# Altium project dmpro16-pcb-v1.PrjPcb
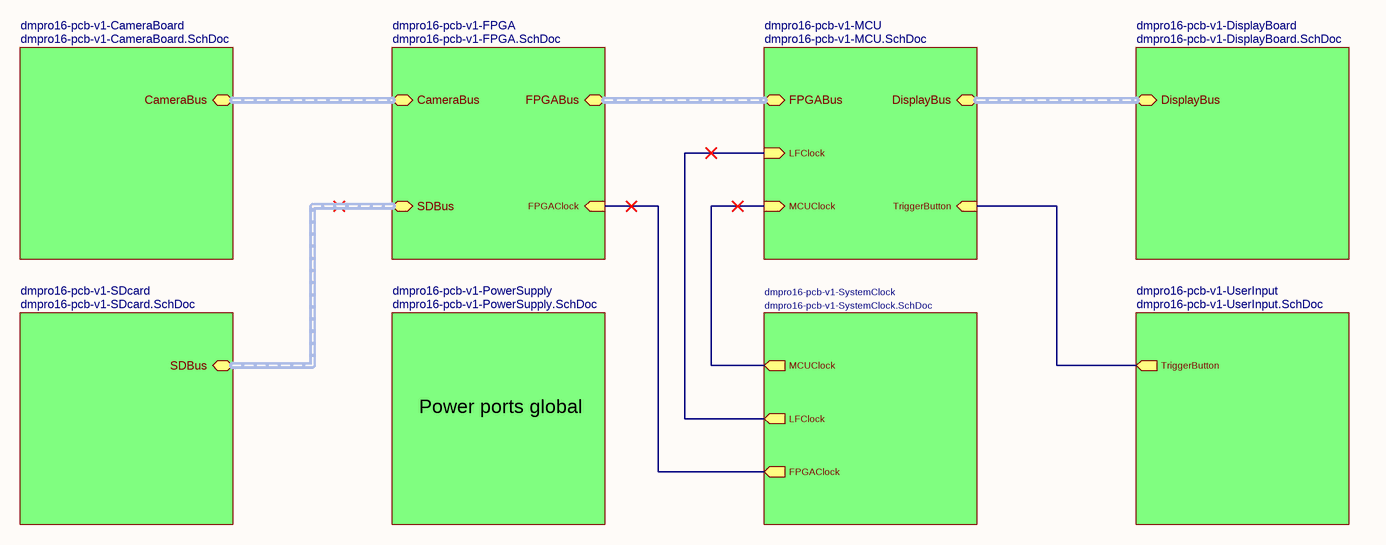
[diagram p0: dmpro16-pcb-v1-TopLevel.SchDoc]
BoardName: sudo -ku; Groupname: Energy; Subject: TDT4295 Computer Project; Version: 1.0
17 sheets, 117 parts. Net scope: hierarchical (ports join the sheet entries above them; power ports are global).
Board file: PCB.PcbDoc
Sheets:
  dmpro16-pcb-v1-TopLevel.SchDoc
    dmpro16-pcb-v1-FPGA = dmpro16-pcb-v1-FPGA.SchDoc
      dmpro16-pcb-v1-FPGA-Bank14 = dmpro16-pcb-v1-FPGA-Bank14.SchDoc
      dmpro16-pcb-v1-FPGA-Bank15 = dmpro16-pcb-v1-FPGA-Bank15.SchDoc
      dmpro16-pcb-v1-FPGA-Bank34 = dmpro16-pcb-v1-FPGA-Bank34.SchDoc
      dmpro16-pcb-v1-FPGA-Bank35 = dmpro16-pcb-v1-FPGA-Bank35.SchDoc
      dmpro16-pcb-v1-FPGA-Power = dmpro16-pcb-v1-FPGA-Power.SchDoc
      dmpro16-pcb-v1-FPGA-Config = dmpro16-pcb-v1-FPGA-Config.SchDoc
    dmpro16-pcb-v1-MCU = dmpro16-pcb-v1-MCU.SchDoc
      dmpro16-pcb-v1-MCU-Power = dmpro16-pcb-v1-MCU-Power.SchDoc
      dmpro16-pcb-v1-MCU-GPIO = dmpro16-pcb-v1-MCU-GPIO.SchDoc
    dmpro16-pcb-v1-CameraBoard = dmpro16-pcb-v1-CameraBoard.SchDoc
    dmpro16-pcb-v1-SDcard = dmpro16-pcb-v1-SDcard.SchDoc
    dmpro16-pcb-v1-DisplayBoard = dmpro16-pcb-v1-DisplayBoard.SchDoc
    dmpro16-pcb-v1-UserInput = dmpro16-pcb-v1-UserInput.SchDoc
    dmpro16-pcb-v1-PowerSupply = dmpro16-pcb-v1-PowerSupply.SchDoc
    dmpro16-pcb-v1-SystemClock = dmpro16-pcb-v1-SystemClock.SchDoc

## Sheet dmpro16-pcb-v1-TopLevel.SchDoc
size A4; DocumentNumber: 1; SheetNumber: 1; SheetTotal: 17; SheetName: TopLevel

### Sub-sheets
dmpro16-pcb-v1-CameraBoard = dmpro16-pcb-v1-CameraBoard.SchDoc: CameraBus (harness CameraBus)
dmpro16-pcb-v1-DisplayBoard = dmpro16-pcb-v1-DisplayBoard.SchDoc: DisplayBus (harness DisplayBus)
dmpro16-pcb-v1-FPGA = dmpro16-pcb-v1-FPGA.SchDoc: CameraBus (harness CameraBus), FPGABus (harness FPGABus), SDBus (harness SDBus), FPGAClock (in)
dmpro16-pcb-v1-MCU = dmpro16-pcb-v1-MCU.SchDoc: FPGABus (harness FPGABus), DisplayBus (harness DisplayBus), MCUClock (in), TriggerButton (in), LFClock (in)
dmpro16-pcb-v1-PowerSupply = dmpro16-pcb-v1-PowerSupply.SchDoc: no entries
dmpro16-pcb-v1-SDcard = dmpro16-pcb-v1-SDcard.SchDoc: SDBus (harness SDBus)
dmpro16-pcb-v1-SystemClock = dmpro16-pcb-v1-SystemClock.SchDoc: MCUClock (out), LFClock (out), FPGAClock (out)
dmpro16-pcb-v1-UserInput = dmpro16-pcb-v1-UserInput.SchDoc: TriggerButton (out)

### Nets
TriggerButton: sheet dmpro16-pcb-v1-MCU/TriggerButton, sheet dmpro16-pcb-v1-UserInput/TriggerButton
NetU1_H2: sheet dmpro16-pcb-v1-FPGA/FPGAClock, sheet dmpro16-pcb-v1-SystemClock/FPGAClock
NetU9_L1: sheet dmpro16-pcb-v1-MCU/LFClock, sheet dmpro16-pcb-v1-SystemClock/LFClock
NetU9_L9: sheet dmpro16-pcb-v1-MCU/MCUClock, sheet dmpro16-pcb-v1-SystemClock/MCUClock

### Buses and harness runs
harness sheet dmpro16-pcb-v1-CameraBoard/CameraBus = sheet dmpro16-pcb-v1-FPGA/CameraBus
harness sheet dmpro16-pcb-v1-DisplayBoard/DisplayBus = sheet dmpro16-pcb-v1-MCU/DisplayBus
harness sheet dmpro16-pcb-v1-FPGA/FPGABus = sheet dmpro16-pcb-v1-MCU/FPGABus
harness sheet dmpro16-pcb-v1-FPGA/SDBus = sheet dmpro16-pcb-v1-SDcard/SDBus

### Notes on the sheet
- Power ports global
- Board:
- Version:
- Sheetname:
- Subject:
- Group:
- Sheet
- of
- Shematic file:

## Sheet dmpro16-pcb-v1-FPGA.SchDoc
size A4; DocumentNumber: 4; SheetNumber: 4; SheetTotal: 17; SheetName: FPGA
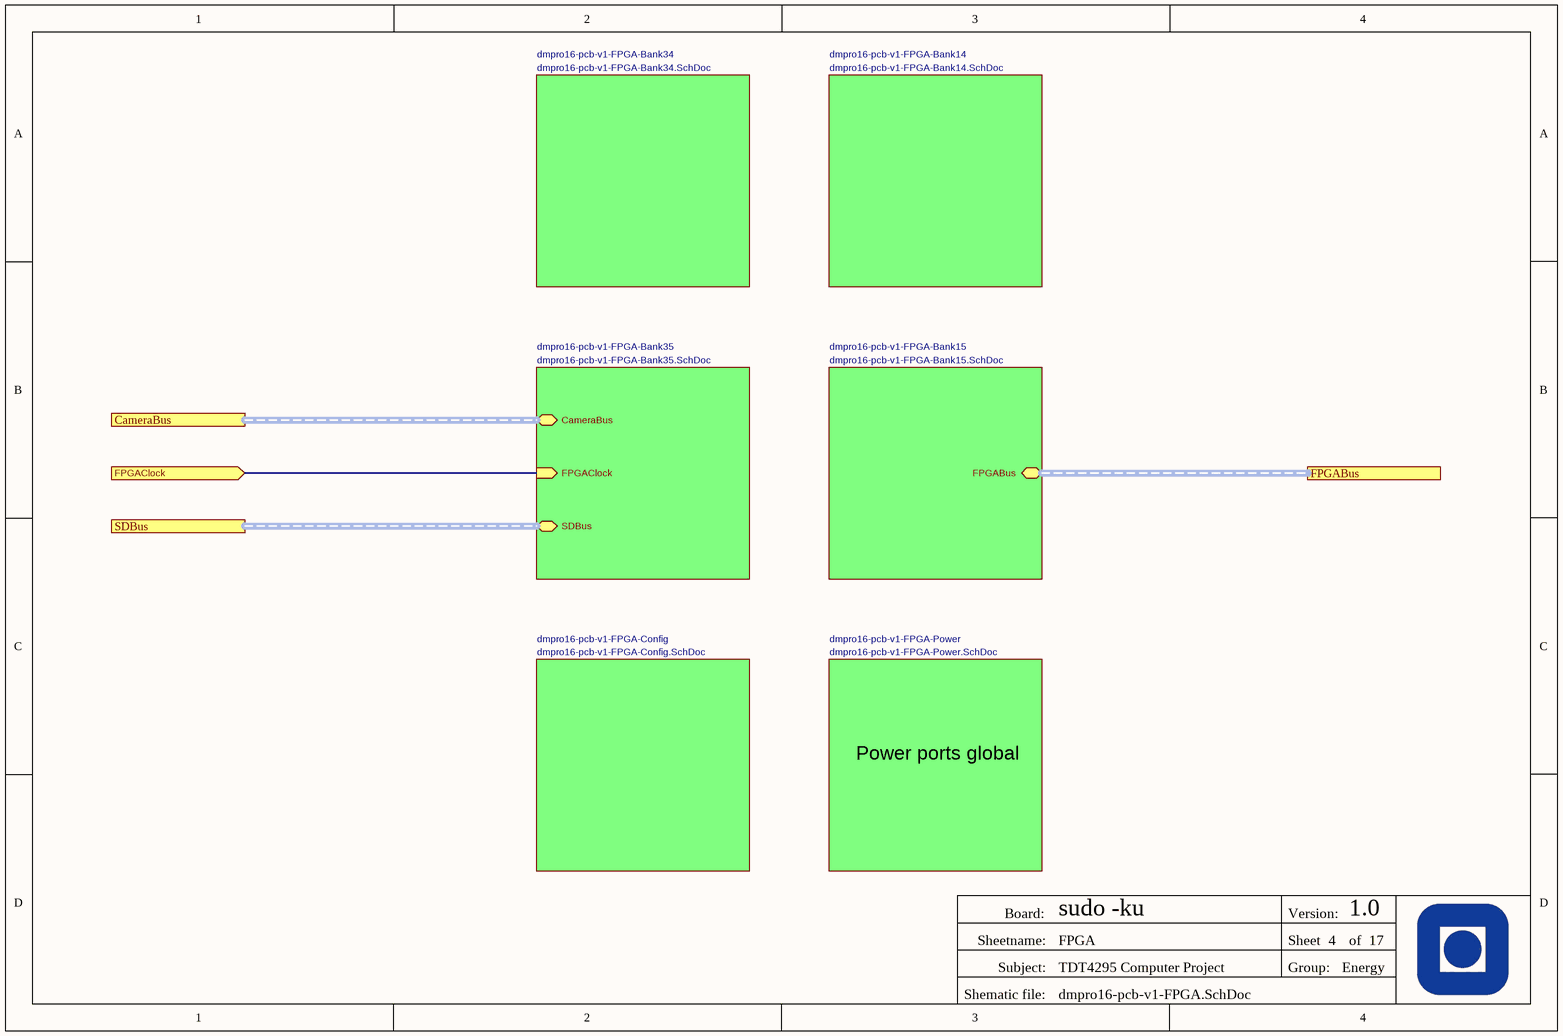
[diagram p1: dmpro16-pcb-v1-FPGA.SchDoc]

### Sub-sheets
dmpro16-pcb-v1-FPGA-Bank14 = dmpro16-pcb-v1-FPGA-Bank14.SchDoc: no entries
dmpro16-pcb-v1-FPGA-Bank15 = dmpro16-pcb-v1-FPGA-Bank15.SchDoc: FPGABus (harness FPGABus)
dmpro16-pcb-v1-FPGA-Bank34 = dmpro16-pcb-v1-FPGA-Bank34.SchDoc: no entries
dmpro16-pcb-v1-FPGA-Bank35 = dmpro16-pcb-v1-FPGA-Bank35.SchDoc: SDBus (harness SDBus), CameraBus (harness CameraBus), FPGAClock (in)
dmpro16-pcb-v1-FPGA-Config = dmpro16-pcb-v1-FPGA-Config.SchDoc: no entries
dmpro16-pcb-v1-FPGA-Power = dmpro16-pcb-v1-FPGA-Power.SchDoc: no entries

### Ports
CameraBus (harness CameraBus), FPGABus (harness FPGABus), FPGAClock (in), SDBus (harness SDBus)

### Nets
NetU1_H2: port FPGAClock, sheet dmpro16-pcb-v1-FPGA-Bank35/FPGAClock

### Buses and harness runs
harness port CameraBus = sheet dmpro16-pcb-v1-FPGA-Bank35/CameraBus
harness port FPGABus = sheet dmpro16-pcb-v1-FPGA-Bank15/FPGABus
harness port SDBus = sheet dmpro16-pcb-v1-FPGA-Bank35/SDBus

### Notes on the sheet
- Power ports global
- Board:
- Version:
- Sheetname:
- Subject:
- Group:
- Sheet
- of
- Shematic file:

## Sheet dmpro16-pcb-v1-FPGA-Bank14.SchDoc
size A4; DocumentNumber: 5; SheetNumber: 5; SheetTotal: 17; SheetName: FPGA-Bank14
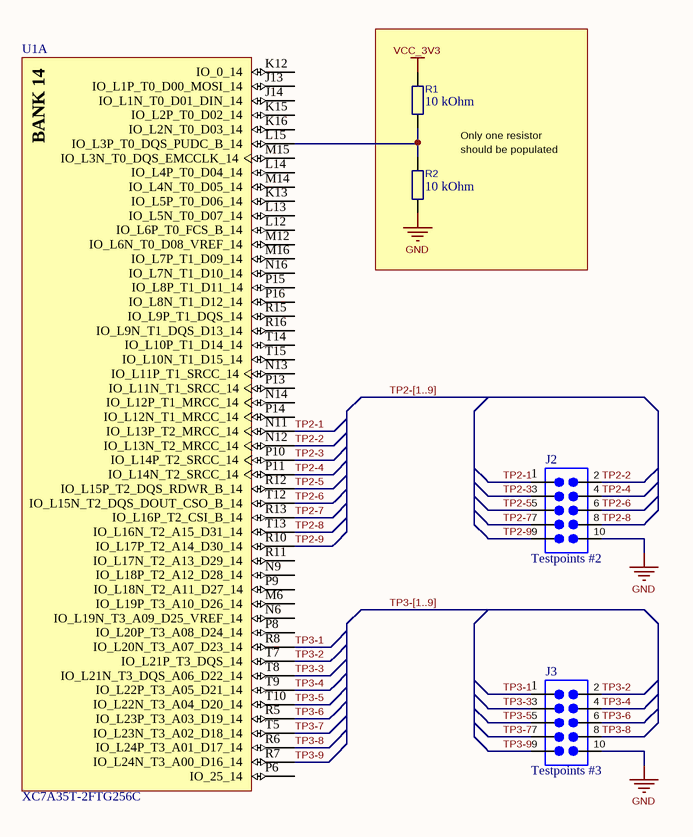
[diagram p2: dmpro16-pcb-v1-FPGA-Bank14.SchDoc]

### Parts
J2  Testpoints #2  [HEADER_2X5]
J3  Testpoints #3  [HEADER_2X5]
R1  10 kOhm  [Resistor 2012]
R2  10 kOhm  [Resistor 2012]
U1  XC7A35T-2FTG256C  [FTG256]  (part A of 8)

### Nets
GND: J2.10 J3.10 R2.2
VCC_3V3: R1.1
TP2-1: J2.1 U1.N11(IO_L13P_T2_MRCC_14)
TP2-2: J2.2 U1.N12(IO_L13N_T2_MRCC_14)
TP2-3: J2.3 U1.P10(IO_L14P_T2_SRCC_14)
TP2-4: J2.4 U1.P11(IO_L14N_T2_SRCC_14)
TP2-5: J2.5 U1.R12(IO_L15P_T2_DQS_RDWR_B_14)
TP2-6: J2.6 U1.T12(IO_L15N_T2_DQS_DOUT_CSO_B_14)
TP2-7: J2.7 U1.R13(IO_L16P_T2_CSI_B_14)
TP2-8: J2.8 U1.T13(IO_L16N_T2_A15_D31_14)
TP2-9: J2.9 U1.R10(IO_L17P_T2_A14_D30_14)
TP3-1: J3.1 U1.R8(IO_L20N_T3_A07_D23_14)
TP3-2: J3.2 U1.T7(IO_L21P_T3_DQS_14)
TP3-3: J3.3 U1.T8(IO_L21N_T3_DQS_A06_D22_14)
TP3-4: J3.4 U1.T9(IO_L22P_T3_A05_D21_14)
TP3-5: J3.5 U1.T10(IO_L22N_T3_A04_D20_14)
TP3-6: J3.6 U1.R5(IO_L23P_T3_A03_D19_14)
TP3-7: J3.7 U1.T5(IO_L23N_T3_A02_D18_14)
TP3-8: J3.8 U1.R6(IO_L24P_T3_A01_D17_14)
TP3-9: J3.9 U1.R7(IO_L24N_T3_A00_D16_14)
NetR1_2: R1.2 R2.1 U1.L15(IO_L3P_T0_DQS_PUDC_B_14)

Not connected (* = marked no-connect by the designer): U1 J13(IO_L1P_T0_D00_MOSI_14) J14(IO_L1N_T0_D01_DIN_14) K12(IO_0_14) K13(IO_L5P_T0_D06_14) K15(IO_L2P_T0_D02_14) K16(IO_L2N_T0_D03_14) L12(IO_L6P_T0_FCS_B_14) L13(IO_L5N_T0_D07_14) L14(IO_L4P_T0_D04_14) M6(IO_L19P_T3_A10_D26_14) M12(IO_L6N_T0_D08_VREF_14) M14(IO_L4N_T0_D05_14) M15(IO_L3N_T0_DQS_EMCCLK_14) M16(IO_L7P_T1_D09_14) N6(IO_L19N_T3_A09_D25_VREF_14) N9(IO_L18P_T2_A12_D28_14) N13(IO_L11P_T1_SRCC_14) N14(IO_L12P_T1_MRCC_14) N16(IO_L7N_T1_D10_14) P6(IO_25_14) P8(IO_L20P_T3_A08_D24_14) P9(IO_L18N_T2_A11_D27_14) P13(IO_L11N_T1_SRCC_14) P14(IO_L12N_T1_MRCC_14) P15(IO_L8P_T1_D11_14) P16(IO_L8N_T1_D12_14) R11(IO_L17N_T2_A13_D29_14) R15(IO_L9P_T1_DQS_14) R16(IO_L9N_T1_DQS_D13_14) T14(IO_L10P_T1_D14_14) T15(IO_L10N_T1_D15_14)

### Buses and harness runs
bus TP2-[1..9]
bus TP3-[1..9]

### Notes on the sheet
- Only one resistor
- should be populated
- Board:
- Version:
- Sheetname:
- Subject:
- Group:
- Sheet
- of
- Shematic file:
- (in symbol XC7A35T-2FTG256C, part A) BANK 14

### Library data of the parts
J2 J3 = con_head_2x05pin: Header 2x05pin
R1 R2 = res_1608_10kohm: 10 kOhm resistor (1608 metric); Watt rating: ? mW; Value: 10 kOhm
U1 = XC7A35T-2FTG256C: Artix-7 FPGA, 170 User I/Os, 0 GTP, 256-Ball BGA, Speed Grade 2, Commercial Grade, Pb-Free; Manufacturer: Xilinx; Total Block RAM: 1800 Kb; GTP: 0; Clock Mgmt Tiles (CMTs): 5; Logic Cells: 33280; Available User I/O: 170; Speed Grades: 2; DatasheetVersion: v1.15; PackageVersion: Rev. 1.11; PackageReference: FTG-256; PackageDescription: 256-Ball Wire-Bond Fine-Pitch Thin BGA, Body 17 x 17 mm, Pitch 1 mm; Maximum Distributed RAM: 400 Kb; Operating Temperature Range: Commercial; NexusDeviceID: XC7A35T-2FTG256C; Mounting Technology: Surface Mount; PartNumber: XC7A35T-2FTG256C; ComponentLink1Description: Manufacturer URL; ComponentLink1URL: http://www.xilinx.com/; ComponentLink2Description: Datasheet; ComponentLink2URL: http://www.xilinx.com/support/documentation/data_sheets/ds180_7Series_Overview.pdf; ComponentLink3Description: Package Specification; ComponentLink3URL: http://www.xilinx.com/support/documentation/user_guides/ug475_7Series_Pkg_Pinout.pdf; ComponentLink4Description: DC and Switching Characteristics; ComponentLink4URL: http://www.xilinx.com/support/documentation/data_sheets/ds181_Artix_7_Data_Sheet.pdf; ComponentLink5Description: Package File; ComponentLink5URL: http://www.xilinx.com/support/packagefiles/a7packages/xc7a200tsbg484pkg.txt; ComponentLink6Description: Packaging and Pinout; ComponentLink6URL: http://www.xilinx.com/support/documentation/user_guides/ug475_7Series_Pkg_Pinout.pdf

## Sheet dmpro16-pcb-v1-FPGA-Bank15.SchDoc
size A4; DocumentNumber: 6; SheetNumber: 6; SheetTotal: 17; SheetName: FPGA-Bank15
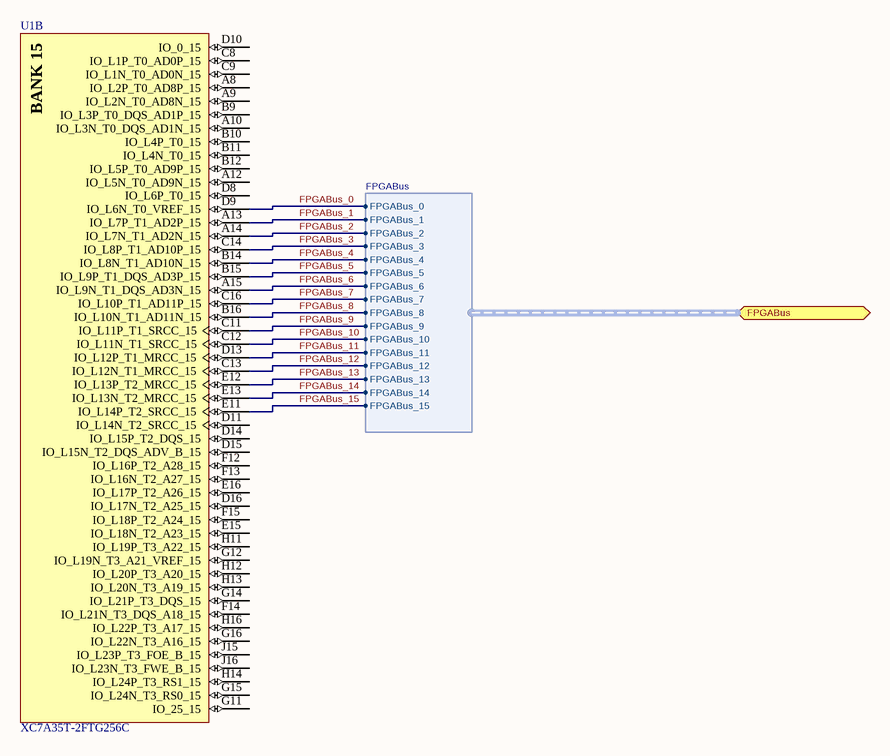
[diagram p3: dmpro16-pcb-v1-FPGA-Bank15.SchDoc]

### Parts
U1  XC7A35T-2FTG256C  [FTG256]  (part B of 8)

### Ports
FPGABus (harness FPGABus)

### Harnesses
FPGABus: FPGABus_0, FPGABus_1, FPGABus_2, FPGABus_3, FPGABus_4, FPGABus_5, FPGABus_6, FPGABus_7, FPGABus_8, FPGABus_9, FPGABus_10, FPGABus_11, FPGABus_12, FPGABus_13, FPGABus_14, FPGABus_15

### Nets
FPGABus_0: U1.D9(IO_L6N_T0_VREF_15) ; port FPGABus.FPGABus_0
FPGABus_1: U1.A13(IO_L7P_T1_AD2P_15) ; port FPGABus.FPGABus_1
FPGABus_2: U1.A14(IO_L7N_T1_AD2N_15) ; port FPGABus.FPGABus_2
FPGABus_3: U1.C14(IO_L8P_T1_AD10P_15) ; port FPGABus.FPGABus_3
FPGABus_4: U1.B14(IO_L8N_T1_AD10N_15) ; port FPGABus.FPGABus_4
FPGABus_5: U1.B15(IO_L9P_T1_DQS_AD3P_15) ; port FPGABus.FPGABus_5
FPGABus_6: U1.A15(IO_L9N_T1_DQS_AD3N_15) ; port FPGABus.FPGABus_6
FPGABus_7: U1.C16(IO_L10P_T1_AD11P_15) ; port FPGABus.FPGABus_7
FPGABus_8: U1.B16(IO_L10N_T1_AD11N_15) ; port FPGABus.FPGABus_8
FPGABus_9: U1.C11(IO_L11P_T1_SRCC_15) ; port FPGABus.FPGABus_9
FPGABus_10: U1.C12(IO_L11N_T1_SRCC_15) ; port FPGABus.FPGABus_10
FPGABus_11: U1.D13(IO_L12P_T1_MRCC_15) ; port FPGABus.FPGABus_11
FPGABus_12: U1.C13(IO_L12N_T1_MRCC_15) ; port FPGABus.FPGABus_12
FPGABus_13: U1.E12(IO_L13P_T2_MRCC_15) ; port FPGABus.FPGABus_13
FPGABus_14: U1.E13(IO_L13N_T2_MRCC_15) ; port FPGABus.FPGABus_14
FPGABus_15: U1.E11(IO_L14P_T2_SRCC_15) ; port FPGABus.FPGABus_15

Not connected (* = marked no-connect by the designer): U1 A8(IO_L2P_T0_AD8P_15) A9(IO_L2N_T0_AD8N_15) A10(IO_L3N_T0_DQS_AD1N_15) A12(IO_L5N_T0_AD9N_15) B9(IO_L3P_T0_DQS_AD1P_15) B10(IO_L4P_T0_15) B11(IO_L4N_T0_15) B12(IO_L5P_T0_AD9P_15) C8(IO_L1P_T0_AD0P_15) C9(IO_L1N_T0_AD0N_15) D8(IO_L6P_T0_15) D10(IO_0_15) D11(IO_L14N_T2_SRCC_15) D14(IO_L15P_T2_DQS_15) D15(IO_L15N_T2_DQS_ADV_B_15) D16(IO_L17N_T2_A25_15) E15(IO_L18N_T2_A23_15) E16(IO_L17P_T2_A26_15) F12(IO_L16P_T2_A28_15) F13(IO_L16N_T2_A27_15) F14(IO_L21N_T3_DQS_A18_15) F15(IO_L18P_T2_A24_15) G11(IO_25_15) G12(IO_L19N_T3_A21_VREF_15) G14(IO_L21P_T3_DQS_15) G15(IO_L24N_T3_RS0_15) G16(IO_L22N_T3_A16_15) H11(IO_L19P_T3_A22_15) H12(IO_L20P_T3_A20_15) H13(IO_L20N_T3_A19_15) H14(IO_L24P_T3_RS1_15) H16(IO_L22P_T3_A17_15) J15(IO_L23P_T3_FOE_B_15) J16(IO_L23N_T3_FWE_B_15)

### Notes on the sheet
- Board:
- Version:
- Sheetname:
- Subject:
- Group:
- Sheet
- of
- Shematic file:
- (in symbol XC7A35T-2FTG256C, part B) BANK 15

### Library data of the parts
U1 = XC7A35T-2FTG256C: as U1 on sheet dmpro16-pcb-v1-FPGA-Bank14; DatasheetVersion: v1.15; PackageVersion: Rev. 1.11; PackageReference: FTG-256; PackageDescription: 256-Ball Wire-Bond Fine-Pitch Thin BGA, Body 17 x 17 mm, Pitch 1 mm; Maximum Distributed RAM: 400 Kb; Operating Temperature Range: Commercial; NexusDeviceID: XC7A35T-2FTG256C; Mounting Technology: Surface Mount; PartNumber: XC7A35T-2FTG256C; ComponentLink1Description: Manufacturer URL; ComponentLink1URL: http://www.xilinx.com/; ComponentLink2Description: Datasheet; ComponentLink2URL: http://www.xilinx.com/support/documentation/data_sheets/ds180_7Series_Overview.pdf; ComponentLink3Description: Package Specification; ComponentLink3URL: http://www.xilinx.com/support/documentation/user_guides/ug475_7Series_Pkg_Pinout.pdf; ComponentLink4Description: DC and Switching Characteristics; ComponentLink4URL: http://www.xilinx.com/support/documentation/data_sheets/ds181_Artix_7_Data_Sheet.pdf; ComponentLink5Description: Package File; ComponentLink5URL: http://www.xilinx.com/support/packagefiles/a7packages/xc7a200tsbg484pkg.txt; ComponentLink6Description: Packaging and Pinout; ComponentLink6URL: http://www.xilinx.com/support/documentation/user_guides/ug475_7Series_Pkg_Pinout.pdf

## Sheet dmpro16-pcb-v1-FPGA-Bank34.SchDoc
size A4; DocumentNumber: 7; SheetNumber: 7; SheetTotal: 17; SheetName: FPGA-Bank34
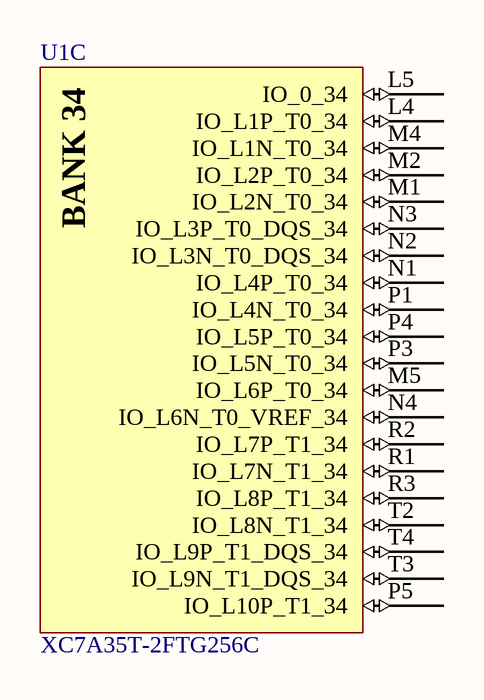
[diagram p4: dmpro16-pcb-v1-FPGA-Bank34.SchDoc]

### Parts
U1  XC7A35T-2FTG256C  [FTG256]  (part C of 8)

### Nets

Not connected (* = marked no-connect by the designer): U1 L4(IO_L1P_T0_34) L5(IO_0_34) M1(IO_L2N_T0_34) M2(IO_L2P_T0_34) M4(IO_L1N_T0_34) M5(IO_L6P_T0_34) N1(IO_L4P_T0_34) N2(IO_L3N_T0_DQS_34) N3(IO_L3P_T0_DQS_34) N4(IO_L6N_T0_VREF_34) P1(IO_L4N_T0_34) P3(IO_L5N_T0_34) P4(IO_L5P_T0_34) P5(IO_L10P_T1_34) R1(IO_L7N_T1_34) R2(IO_L7P_T1_34) R3(IO_L8P_T1_34) T2(IO_L8N_T1_34) T3(IO_L9N_T1_DQS_34) T4(IO_L9P_T1_DQS_34)

### Notes on the sheet
- Board:
- Version:
- Sheetname:
- Subject:
- Group:
- Sheet
- of
- Shematic file:
- (in symbol XC7A35T-2FTG256C, part C) BANK 34

### Library data of the parts
U1 = XC7A35T-2FTG256C: as U1 on sheet dmpro16-pcb-v1-FPGA-Bank14; DatasheetVersion: v1.15; PackageVersion: Rev. 1.11; PackageReference: FTG-256; PackageDescription: 256-Ball Wire-Bond Fine-Pitch Thin BGA, Body 17 x 17 mm, Pitch 1 mm; Maximum Distributed RAM: 400 Kb; Operating Temperature Range: Commercial; NexusDeviceID: XC7A35T-2FTG256C; Mounting Technology: Surface Mount; PartNumber: XC7A35T-2FTG256C; ComponentLink1Description: Manufacturer URL; ComponentLink1URL: http://www.xilinx.com/; ComponentLink2Description: Datasheet; ComponentLink2URL: http://www.xilinx.com/support/documentation/data_sheets/ds180_7Series_Overview.pdf; ComponentLink3Description: Package Specification; ComponentLink3URL: http://www.xilinx.com/support/documentation/user_guides/ug475_7Series_Pkg_Pinout.pdf; ComponentLink4Description: DC and Switching Characteristics; ComponentLink4URL: http://www.xilinx.com/support/documentation/data_sheets/ds181_Artix_7_Data_Sheet.pdf; ComponentLink5Description: Package File; ComponentLink5URL: http://www.xilinx.com/support/packagefiles/a7packages/xc7a200tsbg484pkg.txt; ComponentLink6Description: Packaging and Pinout; ComponentLink6URL: http://www.xilinx.com/support/documentation/user_guides/ug475_7Series_Pkg_Pinout.pdf

## Sheet dmpro16-pcb-v1-FPGA-Bank35.SchDoc
size A4; DocumentNumber: 8; SheetNumber: 8; SheetTotal: 17; SheetName: FPGA-Bank35
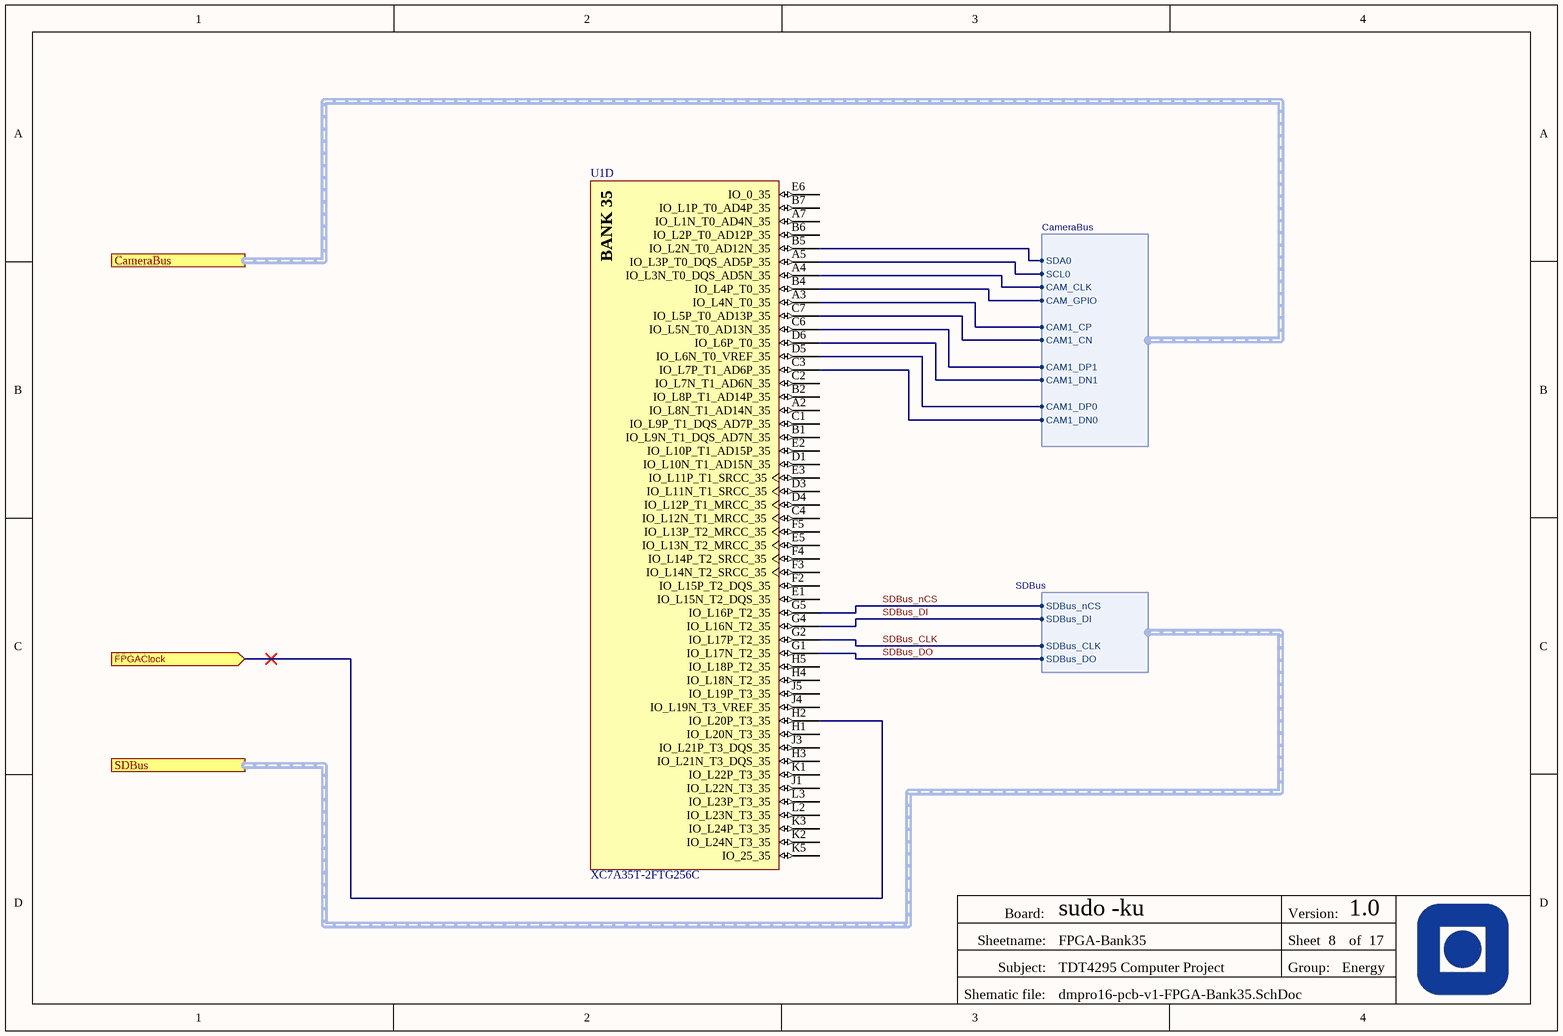
[diagram p5: dmpro16-pcb-v1-FPGA-Bank35.SchDoc]

### Parts
U1  XC7A35T-2FTG256C  [FTG256]  (part D of 8)

### Ports
CameraBus (harness CameraBus), FPGAClock (in), SDBus (harness SDBus)

### Harnesses
SDBus: SDBus_nCS, SDBus_DI, SDBus_CLK, SDBus_DO
CameraBus: SDA0, SCL0, CAM_CLK, CAM_GPIO, CAM1_CP, CAM1_CN, CAM1_DP1, CAM1_DN1, CAM1_DP0, CAM1_DN0

### Nets
CameraBus_CAM1_CN: U1.C7(IO_L5P_T0_AD13P_35) ; port CameraBus.CAM1_CN
CameraBus_CAM1_CP: U1.A3(IO_L4N_T0_35) ; port CameraBus.CAM1_CP
CameraBus_CAM1_DN0: U1.C3(IO_L7P_T1_AD6P_35) ; port CameraBus.CAM1_DN0
CameraBus_CAM1_DN1: U1.D6(IO_L6P_T0_35) ; port CameraBus.CAM1_DN1
CameraBus_CAM1_DP0: U1.D5(IO_L6N_T0_VREF_35) ; port CameraBus.CAM1_DP0
CameraBus_CAM1_DP1: U1.C6(IO_L5N_T0_AD13N_35) ; port CameraBus.CAM1_DP1
CameraBus_CAM_CLK: U1.A4(IO_L3N_T0_DQS_AD5N_35) ; port CameraBus.CAM_CLK
CameraBus_CAM_GPIO: U1.B4(IO_L4P_T0_35) ; port CameraBus.CAM_GPIO
CameraBus_SCL0: U1.A5(IO_L3P_T0_DQS_AD5P_35) ; port CameraBus.SCL0
CameraBus_SDA0: U1.B5(IO_L2N_T0_AD12N_35) ; port CameraBus.SDA0
SDBus_CLK: U1.G2(IO_L17P_T2_35) ; port SDBus.SDBus_CLK
SDBus_DI: U1.G4(IO_L16N_T2_35) ; port SDBus.SDBus_DI
SDBus_DO: U1.G1(IO_L17N_T2_35) ; port SDBus.SDBus_DO
SDBus_nCS: U1.G5(IO_L16P_T2_35) ; port SDBus.SDBus_nCS
NetU1_H2: U1.H2(IO_L20P_T3_35) ; port FPGAClock

Not connected (* = marked no-connect by the designer): U1 A2(IO_L8N_T1_AD14N_35) A7(IO_L1N_T0_AD4N_35) B1(IO_L9N_T1_DQS_AD7N_35) B2(IO_L8P_T1_AD14P_35) B6(IO_L2P_T0_AD12P_35) B7(IO_L1P_T0_AD4P_35) C1(IO_L9P_T1_DQS_AD7P_35) C2(IO_L7N_T1_AD6N_35) C4(IO_L12N_T1_MRCC_35) D1(IO_L10N_T1_AD15N_35) D3(IO_L11N_T1_SRCC_35) D4(IO_L12P_T1_MRCC_35) E1(IO_L15N_T2_DQS_35) E2(IO_L10P_T1_AD15P_35) E3(IO_L11P_T1_SRCC_35) E5(IO_L13N_T2_MRCC_35) E6(IO_0_35) F2(IO_L15P_T2_DQS_35) F3(IO_L14N_T2_SRCC_35) F4(IO_L14P_T2_SRCC_35) F5(IO_L13P_T2_MRCC_35) H1(IO_L20N_T3_35) H3(IO_L21N_T3_DQS_35) H4(IO_L18N_T2_35) H5(IO_L18P_T2_35) J1(IO_L22N_T3_35) J3(IO_L21P_T3_DQS_35) J4(IO_L19N_T3_VREF_35) J5(IO_L19P_T3_35) K1(IO_L22P_T3_35) K2(IO_L24N_T3_35) K3(IO_L24P_T3_35) K5(IO_25_35) L2(IO_L23N_T3_35) L3(IO_L23P_T3_35)

### Notes on the sheet
- Board:
- Version:
- Sheetname:
- Subject:
- Group:
- Sheet
- of
- Shematic file:
- (in symbol XC7A35T-2FTG256C, part D) BANK 35

### Library data of the parts
U1 = XC7A35T-2FTG256C: as U1 on sheet dmpro16-pcb-v1-FPGA-Bank14; DatasheetVersion: v1.15; PackageVersion: Rev. 1.11; PackageReference: FTG-256; PackageDescription: 256-Ball Wire-Bond Fine-Pitch Thin BGA, Body 17 x 17 mm, Pitch 1 mm; Maximum Distributed RAM: 400 Kb; Operating Temperature Range: Commercial; NexusDeviceID: XC7A35T-2FTG256C; Mounting Technology: Surface Mount; PartNumber: XC7A35T-2FTG256C; ComponentLink1Description: Manufacturer URL; ComponentLink1URL: http://www.xilinx.com/; ComponentLink2Description: Datasheet; ComponentLink2URL: http://www.xilinx.com/support/documentation/data_sheets/ds180_7Series_Overview.pdf; ComponentLink3Description: Package Specification; ComponentLink3URL: http://www.xilinx.com/support/documentation/user_guides/ug475_7Series_Pkg_Pinout.pdf; ComponentLink4Description: DC and Switching Characteristics; ComponentLink4URL: http://www.xilinx.com/support/documentation/data_sheets/ds181_Artix_7_Data_Sheet.pdf; ComponentLink5Description: Package File; ComponentLink5URL: http://www.xilinx.com/support/packagefiles/a7packages/xc7a200tsbg484pkg.txt; ComponentLink6Description: Packaging and Pinout; ComponentLink6URL: http://www.xilinx.com/support/documentation/user_guides/ug475_7Series_Pkg_Pinout.pdf

## Sheet dmpro16-pcb-v1-FPGA-Power.SchDoc
size A4; DocumentNumber: 10; SheetNumber: 10; SheetTotal: 17; SheetName: FPGA-Power
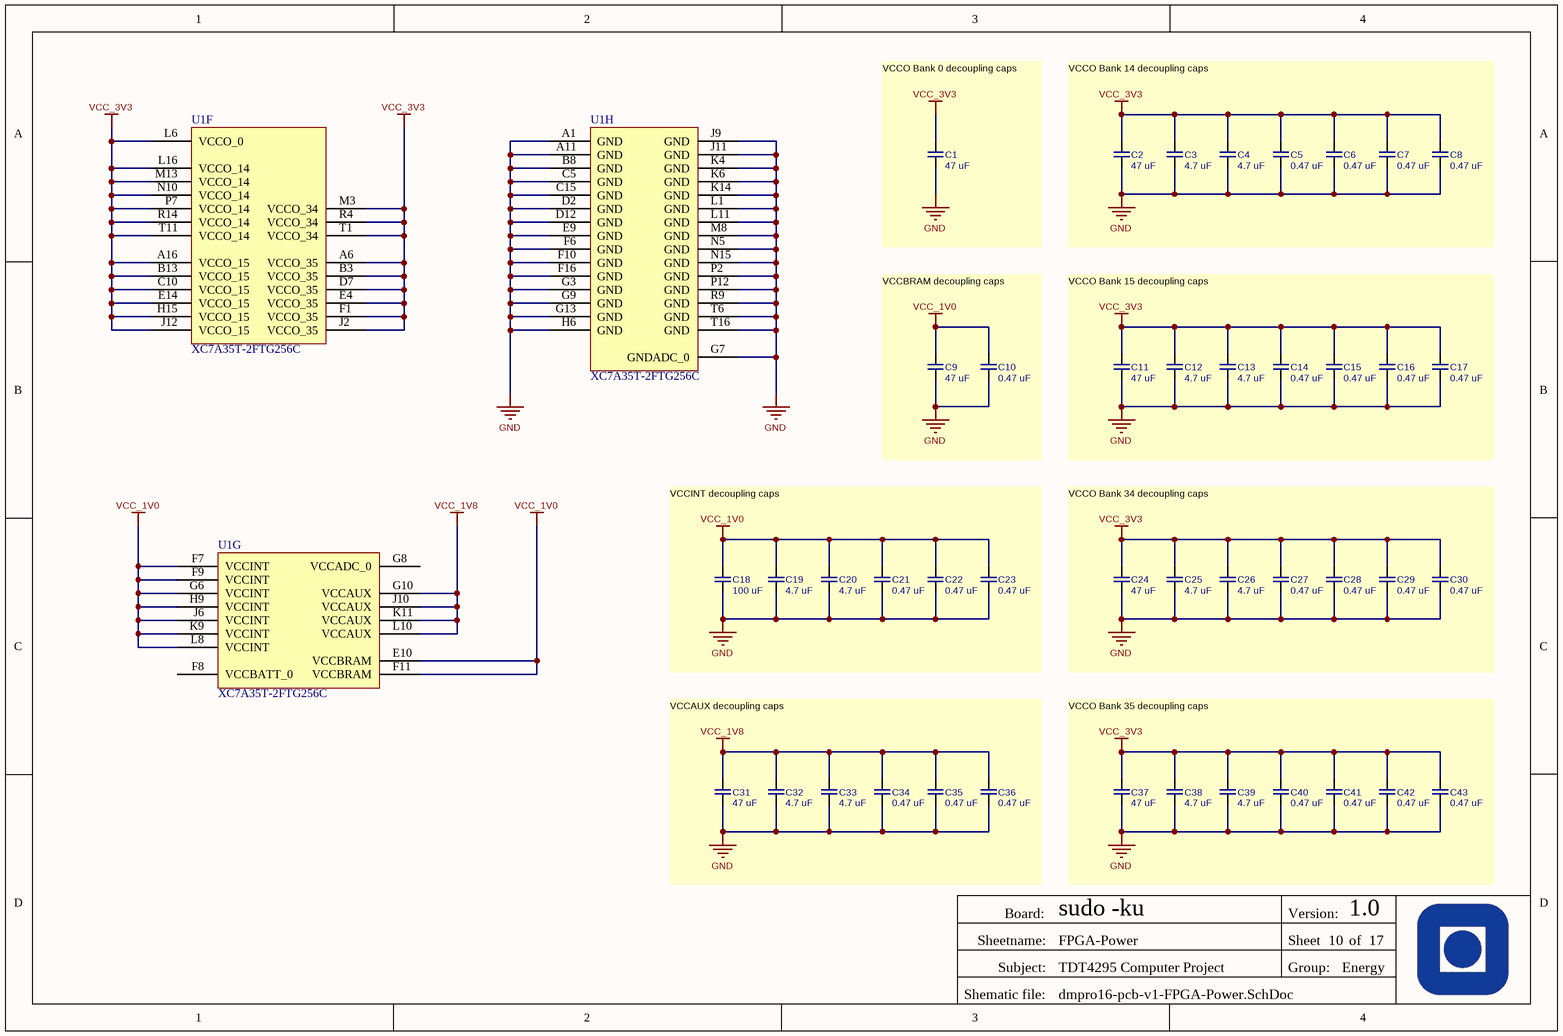
[diagram p6: dmpro16-pcb-v1-FPGA-Power.SchDoc]

### Parts
C1  47 uF  [CAPC2012_0h50]
C2  47 uF  [CAPC2012_0h50]
C3  4.7 uF  [CAPC2012_0h50]
C4  4.7 uF  [CAPC2012_0h50]
C5  0.47 uF  [CAPC2012_0h50]
C6  0.47 uF  [CAPC2012_0h50]
C7  0.47 uF  [CAPC2012_0h50]
C8  0.47 uF  [CAPC2012_0h50]
C9  47 uF  [CAPC2012_0h50]
C10  0.47 uF  [CAPC2012_0h50]
C11  47 uF  [CAPC2012_0h50]
C12  4.7 uF  [CAPC2012_0h50]
C13  4.7 uF  [CAPC2012_0h50]
C14  0.47 uF  [CAPC2012_0h50]
C15  0.47 uF  [CAPC2012_0h50]
C16  0.47 uF  [CAPC2012_0h50]
C17  0.47 uF  [CAPC2012_0h50]
C18  100 uF  [CAPC2012_0h50]
C19  4.7 uF  [CAPC2012_0h50]
C20  4.7 uF  [CAPC2012_0h50]
C21  0.47 uF  [CAPC2012_0h50]
C22  0.47 uF  [CAPC2012_0h50]
C23  0.47 uF  [CAPC2012_0h50]
C24  47 uF  [CAPC2012_0h50]
C25  4.7 uF  [CAPC2012_0h50]
C26  4.7 uF  [CAPC2012_0h50]
C27  0.47 uF  [CAPC2012_0h50]
C28  0.47 uF  [CAPC2012_0h50]
C29  0.47 uF  [CAPC2012_0h50]
C30  0.47 uF  [CAPC2012_0h50]
C31  47 uF  [CAPC2012_0h50]
C32  4.7 uF  [CAPC2012_0h50]
C33  4.7 uF  [CAPC2012_0h50]
C34  0.47 uF  [CAPC2012_0h50]
C35  0.47 uF  [CAPC2012_0h50]
C36  0.47 uF  [CAPC2012_0h50]
C37  47 uF  [CAPC2012_0h50]
C38  4.7 uF  [CAPC2012_0h50]
C39  4.7 uF  [CAPC2012_0h50]
C40  0.47 uF  [CAPC2012_0h50]
C41  0.47 uF  [CAPC2012_0h50]
C42  0.47 uF  [CAPC2012_0h50]
C43  0.47 uF  [CAPC2012_0h50]
U1  XC7A35T-2FTG256C  [FTG256]  (parts F,G,H of 8)

### Nets
GND: C1.1 C2.1 C3.1 C4.1 C5.1 C6.1 C7.1 C8.1 C9.1 C10.1 C11.1 C12.1 C13.1 C14.1 C15.1 C16.1 C17.1 C18.1 C19.1 C20.1 C21.1 C22.1 C23.1 C24.1 C25.1 C26.1 C27.1 C28.1 C29.1 C30.1 C31.1 C32.1 C33.1 C34.1 C35.1 C36.1 C37.1 C38.1 C39.1 C40.1 C41.1 C42.1 C43.1 U1.A1(GND) U1.A11(GND) U1.B8(GND) U1.C5(GND) U1.C15(GND) U1.D2(GND) U1.D12(GND) U1.E9(GND) U1.F6(GND) U1.F10(GND) U1.F16(GND) U1.G3(GND) U1.G7(GNDADC_0) U1.G9(GND) U1.G13(GND) U1.H6(GND) U1.J9(GND) U1.J11(GND) U1.K4(GND) U1.K6(GND) U1.K14(GND) U1.L1(GND) U1.L11(GND) U1.M8(GND) U1.N5(GND) U1.N15(GND) U1.P2(GND) U1.P12(GND) U1.R9(GND) U1.T6(GND) U1.T16(GND)
VCC_1V0: C9.2 C10.2 C18.2 C19.2 C20.2 C21.2 C22.2 C23.2 U1.E10(VCCBRAM) U1.F7(VCCINT) U1.F9(VCCINT) U1.F11(VCCBRAM) U1.G6(VCCINT) U1.H9(VCCINT) U1.J6(VCCINT) U1.K9(VCCINT) U1.L8(VCCINT)
VCC_1V8: C31.2 C32.2 C33.2 C34.2 C35.2 C36.2 U1.G10(VCCAUX) U1.J10(VCCAUX) U1.K11(VCCAUX) U1.L10(VCCAUX)
VCC_3V3: C1.2 C2.2 C3.2 C4.2 C5.2 C6.2 C7.2 C8.2 C11.2 C12.2 C13.2 C14.2 C15.2 C16.2 C17.2 C24.2 C25.2 C26.2 C27.2 C28.2 C29.2 C30.2 C37.2 C38.2 C39.2 C40.2 C41.2 C42.2 C43.2 U1.A6(VCCO_35) U1.A16(VCCO_15) U1.B3(VCCO_35) U1.B13(VCCO_15) U1.C10(VCCO_15) U1.D7(VCCO_35) U1.E4(VCCO_35) U1.E14(VCCO_15) U1.F1(VCCO_35) U1.H15(VCCO_15) U1.J2(VCCO_35) U1.J12(VCCO_15) U1.L6(VCCO_0) U1.L16(VCCO_14) U1.M3(VCCO_34) U1.M13(VCCO_14) U1.N10(VCCO_14) U1.P7(VCCO_14) U1.R4(VCCO_34) U1.R14(VCCO_14) U1.T1(VCCO_34) U1.T11(VCCO_14)

Not connected (* = marked no-connect by the designer): U1 F8(VCCBATT_0) G8(VCCADC_0)

### Notes on the sheet
- (near C1) VCCO Bank 0 decoupling caps
- VCCO Bank 14 decoupling caps
- VCCBRAM decoupling caps
- VCCO Bank 15 decoupling caps
- VCCINT decoupling caps
- VCCO Bank 34 decoupling caps
- VCCAUX decoupling caps
- VCCO Bank 35 decoupling caps
- Board:
- Version:
- Sheetname:
- Subject:
- Group:
- Sheet
- of
- Shematic file:

### Library data of the parts
C1 C2 C9 C11 C24 C31 C37 = cap_unpol_1608_47uF: 47 uF unpolarized capacitor (1608 size); Suggested Part Number: GRM32ER70J476ME20L; Voltage Rating: 6.3 V; Type: 2-Terminal Ceramic X7R or X5R; ESL Maximum: 1 nH; ESR Range: 1 mOhm - 40 mOhm; Value Range: C > 47 uF; Body Size (metric): 3225; Ideal Value: 47 uF
C3 C4 C12 C13 C19 C20 C25 C26 C32 C33 C38 C39 = cap_unpol_1608_4.7uF: 4.7 uF unpolarized capacitor (1608 size); Suggested Part Number: GRM21BR71A475KA73; Voltage Rating: 6.3 V; ESR Range: 1 mOhm - 20 mOhm; ESL Maximum: 0.5 nH; Type: 2-Terminal Ceramic X7R or X5R; Value Range: C > 4.7 uF; Body Size (metric): 2012; Ideal Value: 4.7 uF
C5-C8 C10 C14-C17 C21-C23 C27-C30 C34-C36 C40-C43 = cap_unpol_1608_0.47uF: 0.47 uF unpolarized capacitor (1608 size); Suggested Part Number: GRM188R70J474KA01; Voltage rating: 6.3 V; ESR Range: 1 mOhm - 20 mOhm; ESL Maximum: 0.5 nH; Type: 2-Terminal Ceramic X7R or X5R; Value Range: C > 0.47 uF; Body Size (metric): 1608; Ideal Value: 0.47 uF
C18 = cap_unpol_1608_100uF: 100 uF unpolarized capacitor (1608 size); Suggested Part Number: GRM32ER60J107ME20L; Voltage Rating: 2.5 V; Type: 2-Terminal Tantalum Ceramic X7R or X5R; ESL Maximum: 1 nH; ESR Range: 1 mOhm - 40 mOhm; Value Range: C > 100 uF; Body Size (metric): 3225; Ideal Value: 100 uF
U1 = XC7A35T-2FTG256C: as U1 on sheet dmpro16-pcb-v1-FPGA-Bank14; DatasheetVersion: v1.15; PackageVersion: Rev. 1.11; PackageReference: FTG-256; PackageDescription: 256-Ball Wire-Bond Fine-Pitch Thin BGA, Body 17 x 17 mm, Pitch 1 mm; Maximum Distributed RAM: 400 Kb; Operating Temperature Range: Commercial; NexusDeviceID: XC7A35T-2FTG256C; Mounting Technology: Surface Mount; PartNumber: XC7A35T-2FTG256C; ComponentLink1Description: Manufacturer URL; ComponentLink1URL: http://www.xilinx.com/; ComponentLink2Description: Datasheet; ComponentLink2URL: http://www.xilinx.com/support/documentation/data_sheets/ds180_7Series_Overview.pdf; ComponentLink3Description: Package Specification; ComponentLink3URL: http://www.xilinx.com/support/documentation/user_guides/ug475_7Series_Pkg_Pinout.pdf; ComponentLink4Description: DC and Switching Characteristics; ComponentLink4URL: http://www.xilinx.com/support/documentation/data_sheets/ds181_Artix_7_Data_Sheet.pdf; ComponentLink5Description: Package File; ComponentLink5URL: http://www.xilinx.com/support/packagefiles/a7packages/xc7a200tsbg484pkg.txt; ComponentLink6Description: Packaging and Pinout; ComponentLink6URL: http://www.xilinx.com/support/documentation/user_guides/ug475_7Series_Pkg_Pinout.pdf

## Sheet dmpro16-pcb-v1-FPGA-Config.SchDoc
size A4; DocumentNumber: 9; SheetNumber: 9; SheetTotal: 17; SheetName: FPGA-Config
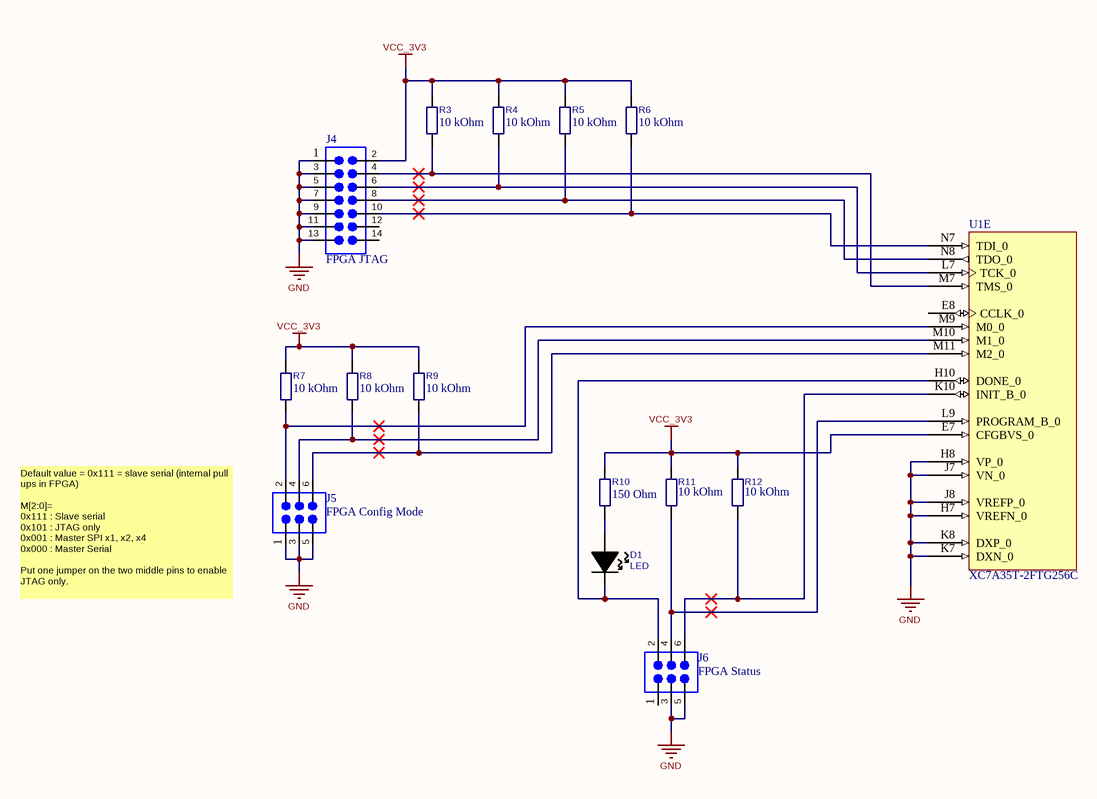
[diagram p7: dmpro16-pcb-v1-FPGA-Config.SchDoc]

### Parts
D1  LED  [LED]
J4  FPGA JTAG  [HEADER_2X7]
J5  FPGA Config Mode  [HEADER_2X3]
J6  FPGA Status  [HEADER_2X3]
R3  10 kOhm  [Resistor 2012]
R4  10 kOhm  [Resistor 2012]
R5  10 kOhm  [Resistor 2012]
R6  10 kOhm  [Resistor 2012]
R7  10 kOhm  [Resistor 2012]
R8  10 kOhm  [Resistor 2012]
R9  10 kOhm  [Resistor 2012]
R10  150 Ohm  [Resistor 2012]
R11  10 kOhm  [Resistor 2012]
R12  10 kOhm  [Resistor 2012]
U1  XC7A35T-2FTG256C  [FTG256]  (part E of 8)

### Nets
GND: J4.1 J4.3 J4.5 J4.7 J4.9 J4.11 J4.13 J5.1 J5.3 J5.5 J6.3 J6.5 U1.H7(VREFN_0) U1.H8(VP_0) U1.J7(VN_0) U1.J8(VREFP_0) U1.K7(DXN_0) U1.K8(DXP_0)
VCC_3V3: J4.2 R3.1 R4.1 R5.1 R6.1 R7.1 R8.1 R9.1 R10.1 R11.1 R12.1 U1.E7(CFGBVS_0)
NetD1_1: D1.1 J6.2 U1.H10(DONE_0)
NetD1_2: D1.2 R10.2
NetJ4_4: J4.4 R3.2 U1.M7(TMS_0)
NetJ4_6: J4.6 R4.2 U1.L7(TCK_0)
NetJ4_8: J4.8 R5.2 U1.N8(TDO_0)
NetJ4_10: J4.10 R6.2 U1.N7(TDI_0)
NetJ5_2: J5.2 R7.2 U1.M9(M0_0)
NetJ5_4: J5.4 R8.2 U1.M10(M1_0)
NetJ5_6: J5.6 R9.2 U1.M11(M2_0)
NetJ6_4: J6.4 R11.2 U1.L9(PROGRAM_B_0)
NetJ6_6: J6.6 R12.2 U1.K10(INIT_B_0)

Not connected (* = marked no-connect by the designer): J4 12 14; J6 1; U1 E8(CCLK_0)

### Notes on the sheet
- (near J5) Default value = 0x111 = slave serial (internal pull ups in FPGA)
  M[2:0]=
  0x111 : Slave serial
  0x101 : JTAG only
  0x001 : Master SPI x1, x2, x4
  0x000 : Master Serial
  Put one jumper on the two middle pins to enable JTAG only.
- Board:
- Version:
- Sheetname:
- Subject:
- Group:
- Sheet
- of
- Shematic file:

### Library data of the parts
D1 = disp_led
J4 = con_head_2x07pin: Header 2x07pin
J5 J6 = con_head_2x03pin: Header 2x03pin
R3-R9 R11 R12 = res_1608_10kohm: as R1 on sheet dmpro16-pcb-v1-FPGA-Bank14; Value: 10 kOhm
R10 = res_1608_150ohm: 150 Ohm resistor (1608 metric); Watt rating: ? mW; Value: 150 Ohm
U1 = XC7A35T-2FTG256C: as U1 on sheet dmpro16-pcb-v1-FPGA-Bank14; DatasheetVersion: v1.15; PackageVersion: Rev. 1.11; PackageReference: FTG-256; PackageDescription: 256-Ball Wire-Bond Fine-Pitch Thin BGA, Body 17 x 17 mm, Pitch 1 mm; Maximum Distributed RAM: 400 Kb; Operating Temperature Range: Commercial; NexusDeviceID: XC7A35T-2FTG256C; Mounting Technology: Surface Mount; PartNumber: XC7A35T-2FTG256C; ComponentLink1Description: Manufacturer URL; ComponentLink1URL: http://www.xilinx.com/; ComponentLink2Description: Datasheet; ComponentLink2URL: http://www.xilinx.com/support/documentation/data_sheets/ds180_7Series_Overview.pdf; ComponentLink3Description: Package Specification; ComponentLink3URL: http://www.xilinx.com/support/documentation/user_guides/ug475_7Series_Pkg_Pinout.pdf; ComponentLink4Description: DC and Switching Characteristics; ComponentLink4URL: http://www.xilinx.com/support/documentation/data_sheets/ds181_Artix_7_Data_Sheet.pdf; ComponentLink5Description: Package File; ComponentLink5URL: http://www.xilinx.com/support/packagefiles/a7packages/xc7a200tsbg484pkg.txt; ComponentLink6Description: Packaging and Pinout; ComponentLink6URL: http://www.xilinx.com/support/documentation/user_guides/ug475_7Series_Pkg_Pinout.pdf

## Sheet dmpro16-pcb-v1-MCU.SchDoc
size A4; DocumentNumber: 11; SheetNumber: 11; SheetTotal: 17; SheetName: MCU
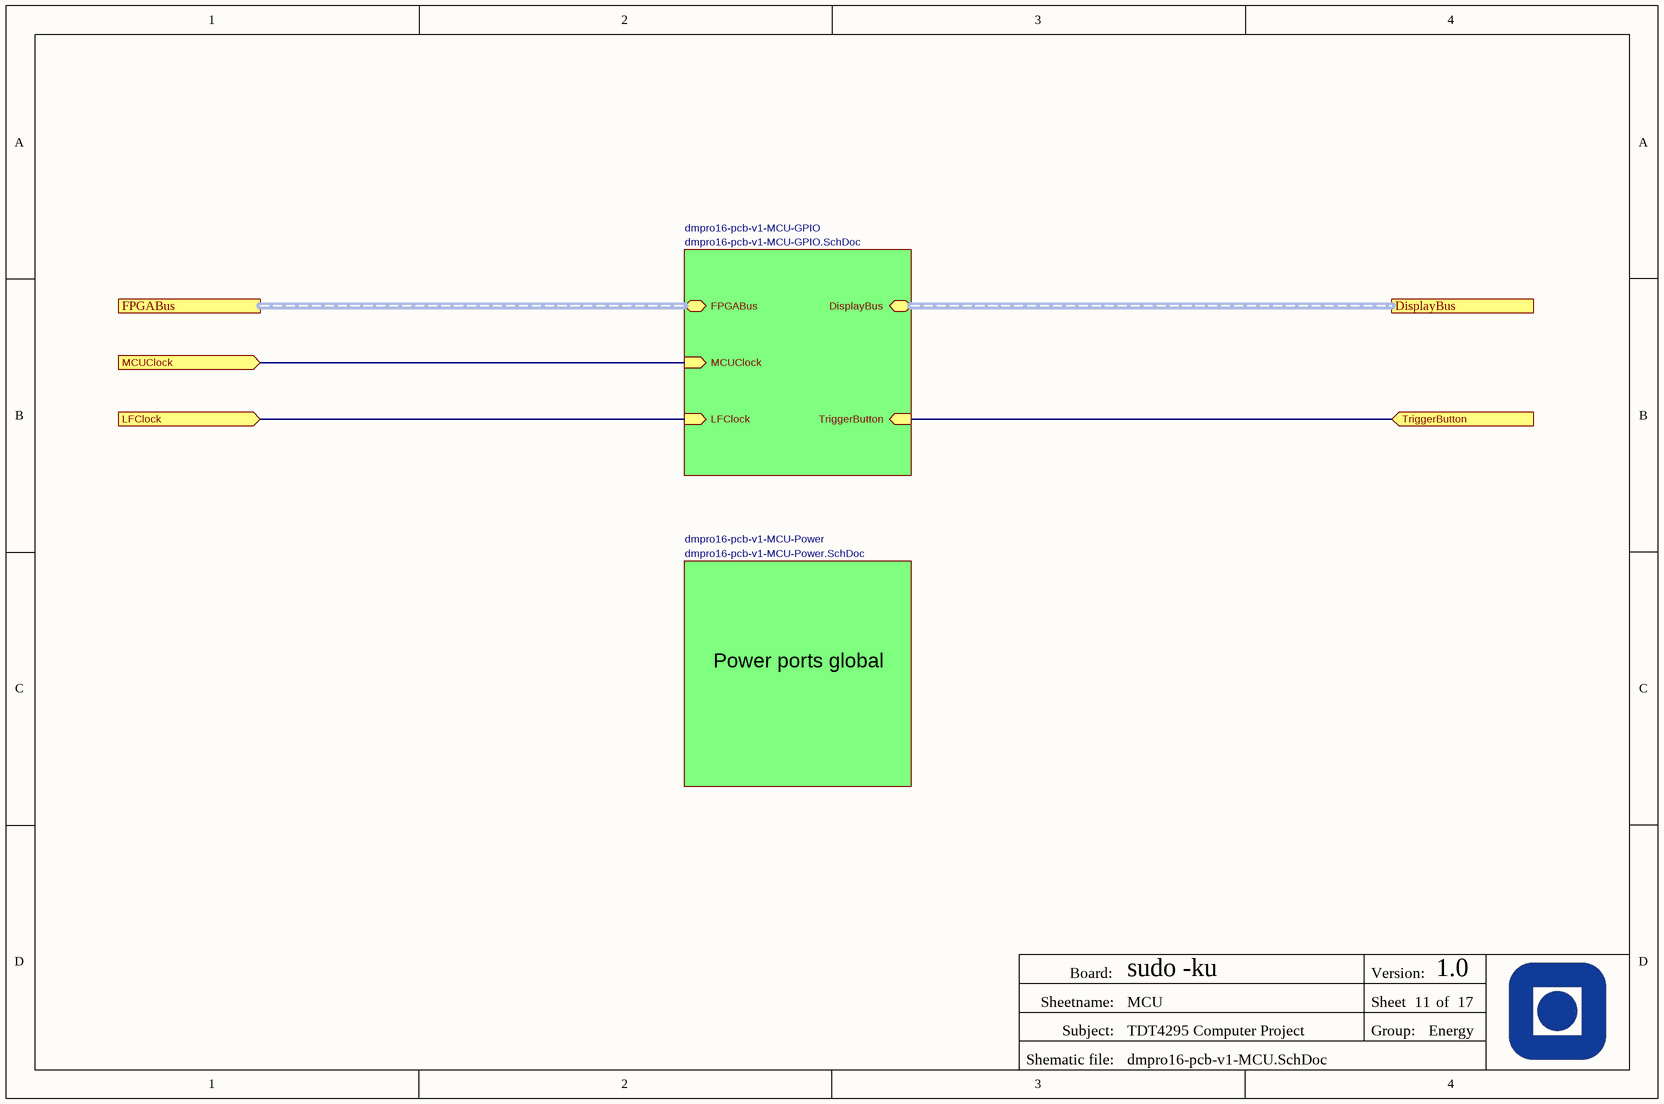
[diagram p8: dmpro16-pcb-v1-MCU.SchDoc]

### Sub-sheets
dmpro16-pcb-v1-MCU-GPIO = dmpro16-pcb-v1-MCU-GPIO.SchDoc: FPGABus (harness FPGABus), DisplayBus (harness DisplayBus), TriggerButton (in), MCUClock (in), LFClock (in)
dmpro16-pcb-v1-MCU-Power = dmpro16-pcb-v1-MCU-Power.SchDoc: no entries

### Ports
DisplayBus (harness DisplayBus), FPGABus (harness FPGABus), LFClock (in), MCUClock (in), TriggerButton (in)

### Nets
TriggerButton: port TriggerButton, sheet dmpro16-pcb-v1-MCU-GPIO/TriggerButton
NetU9_L1: port LFClock, sheet dmpro16-pcb-v1-MCU-GPIO/LFClock
NetU9_L9: port MCUClock, sheet dmpro16-pcb-v1-MCU-GPIO/MCUClock

### Buses and harness runs
harness port DisplayBus = sheet dmpro16-pcb-v1-MCU-GPIO/DisplayBus
harness port FPGABus = sheet dmpro16-pcb-v1-MCU-GPIO/FPGABus

### Notes on the sheet
- Power ports global
- Board:
- Version:
- Sheetname:
- Subject:
- Group:
- Sheet
- of
- Shematic file:

## Sheet dmpro16-pcb-v1-MCU-Power.SchDoc
size A4; DocumentNumber: 13; SheetNumber: 13; SheetTotal: 17; SheetName: MCU-Power
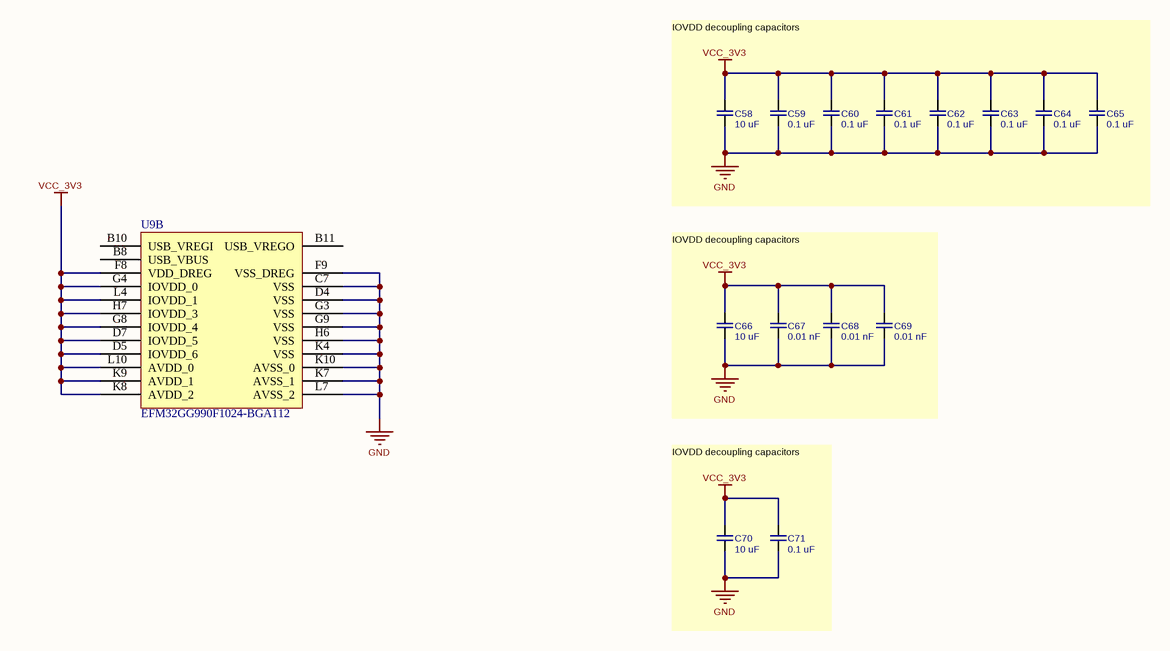
[diagram p9: dmpro16-pcb-v1-MCU-Power.SchDoc]

### Parts
C58  10 uF  [CAPC2012_0h50]
C59  0.1 uF  [CAPC2012_0h50]
C60  0.1 uF  [CAPC2012_0h50]
C61  0.1 uF  [CAPC2012_0h50]
C62  0.1 uF  [CAPC2012_0h50]
C63  0.1 uF  [CAPC2012_0h50]
C64  0.1 uF  [CAPC2012_0h50]
C65  0.1 uF  [CAPC2012_0h50]
C66  10 uF  [CAPC2012_0h50]
C67  0.01 nF  [CAPC2012_0h50]
C68  0.01 nF  [CAPC2012_0h50]
C69  0.01 nF  [CAPC2012_0h50]
C70  10 uF  [CAPC2012_0h50]
C71  0.1 uF  [CAPC2012_0h50]
U9  EFM32GG990F1024-BGA112  [ENMR-BGA112]  (part B of 2)

### Nets
GND: C58.1 C59.1 C60.1 C61.1 C62.1 C63.1 C64.1 C65.1 C66.1 C67.1 C68.1 C69.1 C70.1 C71.1 U9.C7(VSS) U9.D4(VSS) U9.F9(VSS_DREG) U9.G3(VSS) U9.G9(VSS) U9.H6(VSS) U9.K4(VSS) U9.K7(AVSS_1) U9.K10(AVSS_0) U9.L7(AVSS_2)
VCC_3V3: C58.2 C59.2 C60.2 C61.2 C62.2 C63.2 C64.2 C65.2 C66.2 C67.2 C68.2 C69.2 C70.2 C71.2 U9.D5(IOVDD_6) U9.D7(IOVDD_5) U9.F8(VDD_DREG) U9.G4(IOVDD_0) U9.G8(IOVDD_4) U9.H7(IOVDD_3) U9.K8(AVDD_2) U9.K9(AVDD_1) U9.L4(IOVDD_1) U9.L10(AVDD_0)

Not connected (* = marked no-connect by the designer): U9 B8(USB_VBUS) B10(USB_VREGI) B11(USB_VREGO)

### Notes on the sheet
- IOVDD decoupling capacitors
- Board:
- Version:
- Sheetname:
- Subject:
- Group:
- Sheet
- of
- Shematic file:

### Library data of the parts
C58 C66 C70 = cap_unpol_1608_10uF: 10 uF unpolarized capacitor (1608 size); Voltage Rating: 6.3 V; Body Size (metric): 1608; Ideal Value: 10 uF
C59-C65 C71 = cap_unpol_1608_0.1uF: 0.1 uF unpolarized capacitor (1608 size); Voltage Rating: 6.3 V; Body Size (metric): 1608; Ideal Value: 0.1 uF
C67-C69 = cap_unpol_1608_0.01uF: 0.01 uF unpolarized capacitor (1608 size); Voltage Rating: 6.3 V; Body Size (metric): 1608; Ideal Value: 0.01 nF
U9 = EFM32GG990F1024-BGA112: EFM32 Giant Gecko, M3 ARM Cortex CPU, 1024 KB Flash, 128 KB RAM, 1.85 - 3.8 V Supply, 48 MHz Max Speed, -40 to 85 degC, 112-Pin BGA, RoHS Compliant; Flash (KB): 1024; GPIO: 87; LCD: 8x34; LESENSE: Y; Max Speed (MHz): 48; OPAMPS: 3; RAM (KB): 128; DatasheetVersion: Rev 1.00; PackageVersion: Rev. 97SPP01315A_X03_06Jun11; PackageReference: BGA112; PackageDescription: 112-Pin Ball Grid Array, Body 10 x 10 mm, Pitch 0.8 mm; Supplier 1: Digi-Key; Supplier Part Number 1: 914-1051-2-ND; Supplier 2: Digi-Key; Supplier Part Number 2: 914-1051-1-ND; Supplier 3: Digi-Key; Supplier Part Number 3: 914-1051-6-ND; Supplier 4: Mouser; Supplier Part Number 4: 904-EFM32GG990F1024; ARM Cortex CPU: M3; Subcategory: EFM32 Giant Gecko; Supply Voltage (V): 1.85 - 3.8; USB: Y; Mounting Technology: Surface Mount; Generic Part Number: EFM32GG990; PartNumber: EFM32GG990F1024-BGA112; ComponentLink1Description: Manufacturer URL; ComponentLink1URL: http://www.energymicro.com/; ComponentLink2Description: Datasheet; ComponentLink2URL: http://cdn.energymicro.com/dl/devices/pdf/d0046_efm32gg990_datasheet.pdf; ComponentLink3Description: Package Specification; ComponentLink3URL: http://cdn.energymicro.com/dl/devices/pdf/d0007_efm32g290_datasheet.pdf

## Sheet dmpro16-pcb-v1-MCU-GPIO.SchDoc
size A4; DocumentNumber: 12; SheetNumber: 12; SheetTotal: 17; SheetName: MCU-GPIO
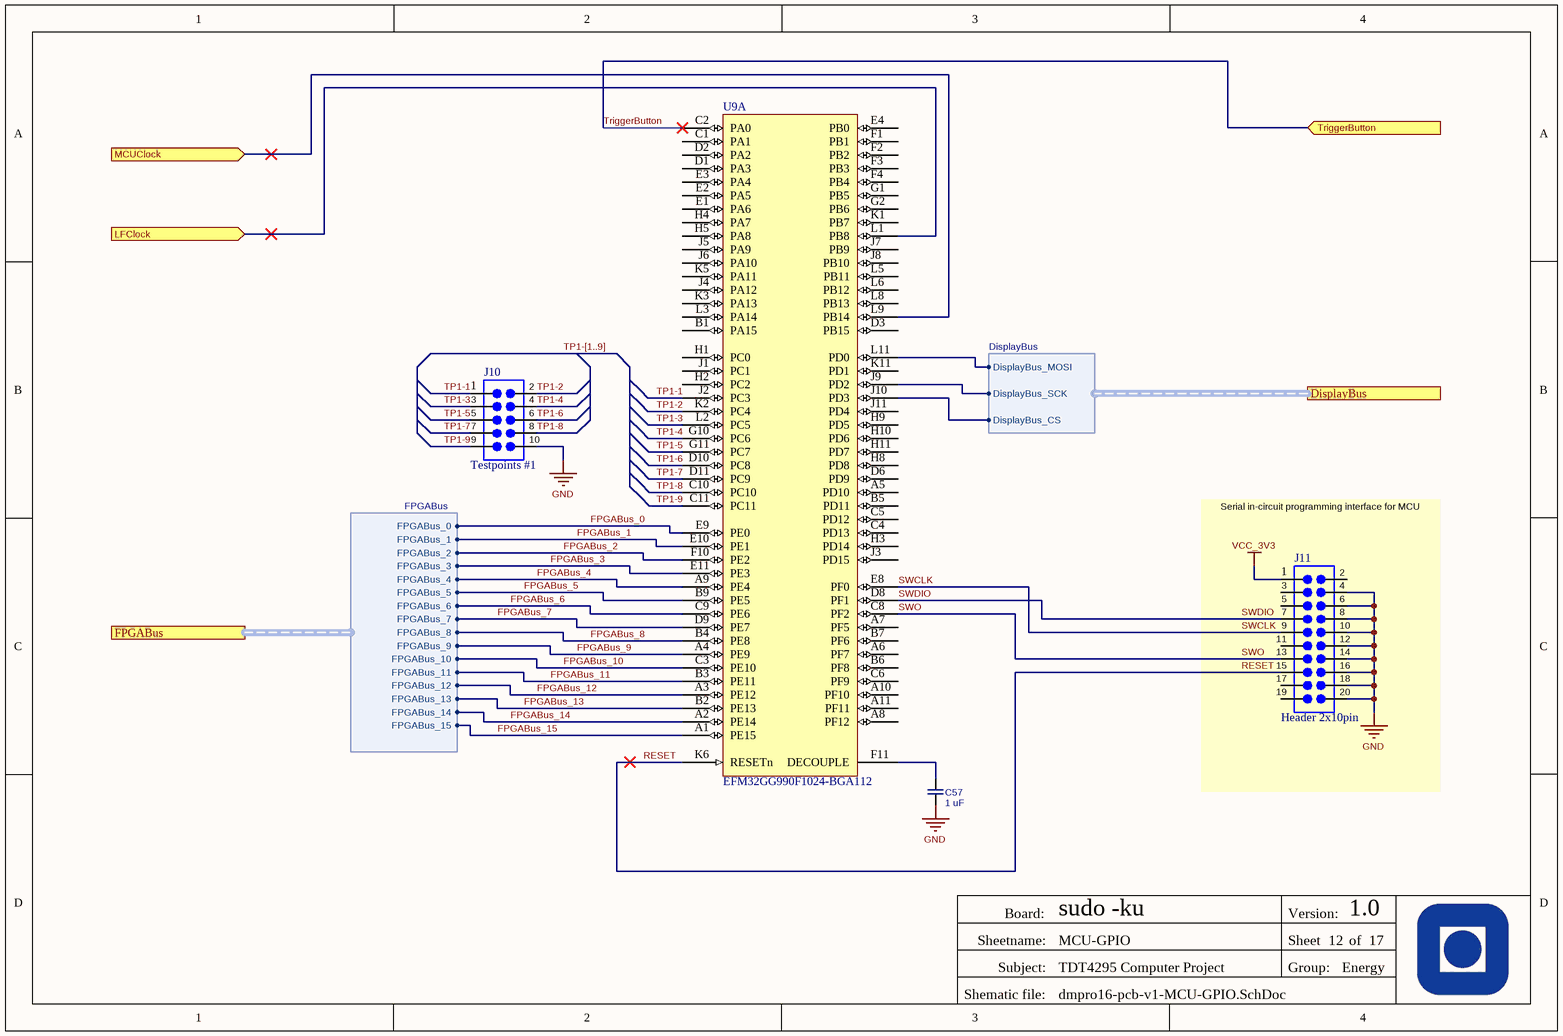
[diagram p10: dmpro16-pcb-v1-MCU-GPIO.SchDoc]

### Parts
C57  1 uF  [CAPC2012_0h50]
J10  Testpoints #1  [HEADER_2X5]
J11  Header 2x10pin  [HEADER_2X10]
U9  EFM32GG990F1024-BGA112  [ENMR-BGA112]  (part A of 2)

### Ports
DisplayBus (harness DisplayBus), FPGABus (harness FPGABus), LFClock (in), MCUClock (in), TriggerButton (in)

### Harnesses
DisplayBus: DisplayBus_MOSI, DisplayBus_SCK, DisplayBus_CS
FPGABus: FPGABus_0, FPGABus_1, FPGABus_2, FPGABus_3, FPGABus_4, FPGABus_5, FPGABus_6, FPGABus_7, FPGABus_8, FPGABus_9, FPGABus_10, FPGABus_11, FPGABus_12, FPGABus_13, FPGABus_14, FPGABus_15

### Nets
GND: C57.1 J10.10 J11.4 J11.6 J11.8 J11.10 J11.12 J11.14 J11.16 J11.18 J11.20
VCC_3V3: J11.1
FPGABus_0: U9.E9(PE0) ; port FPGABus.FPGABus_0
FPGABus_1: U9.E10(PE1) ; port FPGABus.FPGABus_1
FPGABus_2: U9.F10(PE2) ; port FPGABus.FPGABus_2
FPGABus_3: U9.E11(PE3) ; port FPGABus.FPGABus_3
FPGABus_4: U9.A9(PE4) ; port FPGABus.FPGABus_4
FPGABus_5: U9.B9(PE5) ; port FPGABus.FPGABus_5
FPGABus_6: U9.C9(PE6) ; port FPGABus.FPGABus_6
FPGABus_7: U9.D9(PE7) ; port FPGABus.FPGABus_7
FPGABus_8: U9.B4(PE8) ; port FPGABus.FPGABus_8
FPGABus_9: U9.A4(PE9) ; port FPGABus.FPGABus_9
FPGABus_10: U9.C3(PE10) ; port FPGABus.FPGABus_10
FPGABus_11: U9.B3(PE11) ; port FPGABus.FPGABus_11
FPGABus_12: U9.A3(PE12) ; port FPGABus.FPGABus_12
FPGABus_13: U9.B2(PE13) ; port FPGABus.FPGABus_13
FPGABus_14: U9.A2(PE14) ; port FPGABus.FPGABus_14
FPGABus_15: U9.A1(PE15) ; port FPGABus.FPGABus_15
RESET: J11.15 U9.K6(RESETn)
SWCLK: J11.9 U9.E8(PF0)
SWDIO: J11.7 U9.D8(PF1)
SWO: J11.13 U9.C8(PF2)
TP1-1: J10.1 U9.J2(PC3)
TP1-2: J10.2 U9.K2(PC4)
TP1-3: J10.3 U9.L2(PC5)
TP1-4: J10.4 U9.G10(PC6)
TP1-5: J10.5 U9.G11(PC7)
TP1-6: J10.6 U9.D10(PC8)
TP1-7: J10.7 U9.D11(PC9)
TP1-8: J10.8 U9.C10(PC10)
TP1-9: J10.9 U9.C11(PC11)
TriggerButton: U9.C2(PA0) ; port TriggerButton
NetC57_2: C57.2 U9.F11(DECOUPLE)
NetLCD1_4: U9.J9(PD2) ; port DisplayBus.DisplayBus_SCK
NetLCD1_5: U9.L11(PD0) ; port DisplayBus.DisplayBus_MOSI
NetLCD1_6: U9.J10(PD3) ; port DisplayBus.DisplayBus_CS
NetU9_L1: U9.L1(PB8) ; port LFClock
NetU9_L9: U9.L9(PB14) ; port MCUClock

Not connected (* = marked no-connect by the designer): J11 2 3 5 11 17 19; U9 A5(PD10) A6(PF7) A7(PF5) A8(PF12) A10(PF10) A11(PF11) B1(PA15) B5(PD11) B6(PF8) B7(PF6) C1(PA1) C4(PD13) C5(PD12) C6(PF9) D1(PA3) D2(PA2) D3(PB15) D6(PD9) E1(PA6) E2(PA5) E3(PA4) E4(PB0) F1(PB1) F2(PB2) F3(PB3) F4(PB4) G1(PB5) G2(PB6) H1(PC0) H2(PC2) H3(PD14) H4(PA7) H5(PA8) H8(PD8) H9(PD5) H10(PD6) H11(PD7) J1(PC1) J3(PD15) J4(PA12) J5(PA9) J6(PA10) J7(PB9) J8(PB10) J11(PD4) K1(PB7) K3(PA13) K5(PA11) K11(PD1) L3(PA14) L5(PB11) L6(PB12) L8(PB13)

### Buses and harness runs
bus TP1-[1..9]

### Notes on the sheet
- (near J11) Serial in-circuit programming interface for MCU
- Board:
- Version:
- Sheetname:
- Subject:
- Group:
- Sheet
- of
- Shematic file:

### Library data of the parts
C57 = cap_unpol_1608_1uF: 1 uF unpolarized capacitor (1608 size); Voltage Rating: 6.3 V; Body Size (metric): 1608; Ideal Value: 1 uF
J10 = con_head_2x05pin: Header 2x05pin
J11 = con_head_2x10pin
U9 = EFM32GG990F1024-BGA112: as U9 on sheet dmpro16-pcb-v1-MCU-Power; DatasheetVersion: Rev 1.00; PackageVersion: Rev. 97SPP01315A_X03_06Jun11; PackageReference: BGA112; PackageDescription: 112-Pin Ball Grid Array, Body 10 x 10 mm, Pitch 0.8 mm; Supplier 1: Digi-Key; Supplier Part Number 1: 914-1051-2-ND; Supplier 2: Digi-Key; Supplier Part Number 2: 914-1051-1-ND; Supplier 3: Digi-Key; Supplier Part Number 3: 914-1051-6-ND; Supplier 4: Mouser; Supplier Part Number 4: 904-EFM32GG990F1024; ARM Cortex CPU: M3; Subcategory: EFM32 Giant Gecko; Supply Voltage (V): 1.85 - 3.8; USB: Y; Mounting Technology: Surface Mount; Generic Part Number: EFM32GG990; PartNumber: EFM32GG990F1024-BGA112; ComponentLink1Description: Manufacturer URL; ComponentLink1URL: http://www.energymicro.com/; ComponentLink2Description: Datasheet; ComponentLink2URL: http://cdn.energymicro.com/dl/devices/pdf/d0046_efm32gg990_datasheet.pdf; ComponentLink3Description: Package Specification; ComponentLink3URL: http://cdn.energymicro.com/dl/devices/pdf/d0007_efm32g290_datasheet.pdf

## Sheet dmpro16-pcb-v1-CameraBoard.SchDoc
size A4; Organization: Altium Limited; Address1: L3, 12a Rodborough Rd; Address2: Frenchs Forest; Address3: NSW; Address4: Australia 2086; DocumentNumber: 2; SheetNumber: 2; SheetTotal: 17; SheetName: CameraBoard
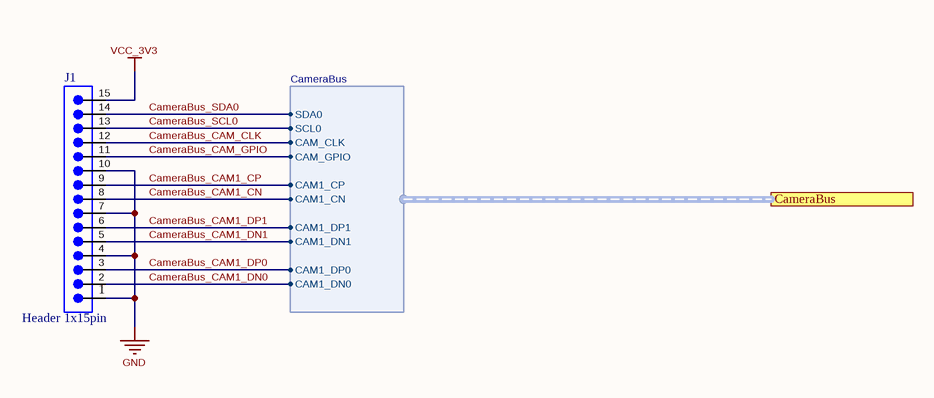
[diagram p11: dmpro16-pcb-v1-CameraBoard.SchDoc]

### Parts
J1  Header 1x15pin  [ZIF-15]

### Ports
CameraBus (harness CameraBus)

### Harnesses
CameraBus: SDA0, SCL0, CAM_CLK, CAM_GPIO, CAM1_CP, CAM1_CN, CAM1_DP1, CAM1_DN1, CAM1_DP0, CAM1_DN0

### Nets
GND: J1.1 J1.4 J1.7 J1.10
VCC_3V3: J1.15
CameraBus_CAM1_CN: J1.8 ; port CameraBus.CAM1_CN
CameraBus_CAM1_CP: J1.9 ; port CameraBus.CAM1_CP
CameraBus_CAM1_DN0: J1.2 ; port CameraBus.CAM1_DN0
CameraBus_CAM1_DN1: J1.5 ; port CameraBus.CAM1_DN1
CameraBus_CAM1_DP0: J1.3 ; port CameraBus.CAM1_DP0
CameraBus_CAM1_DP1: J1.6 ; port CameraBus.CAM1_DP1
CameraBus_CAM_CLK: J1.12 ; port CameraBus.CAM_CLK
CameraBus_CAM_GPIO: J1.11 ; port CameraBus.CAM_GPIO
CameraBus_SCL0: J1.13 ; port CameraBus.SCL0
CameraBus_SDA0: J1.14 ; port CameraBus.SDA0

### Notes on the sheet
- Board:
- Version:
- Sheetname:
- Subject:
- Group:
- Sheet
- of
- Shematic file:

### Library data of the parts
J1 = con_head_1x15pin

## Sheet dmpro16-pcb-v1-SDcard.SchDoc
size A4; DocumentNumber: 15; SheetNumber: 15; SheetTotal: 17; SheetName: SDcard
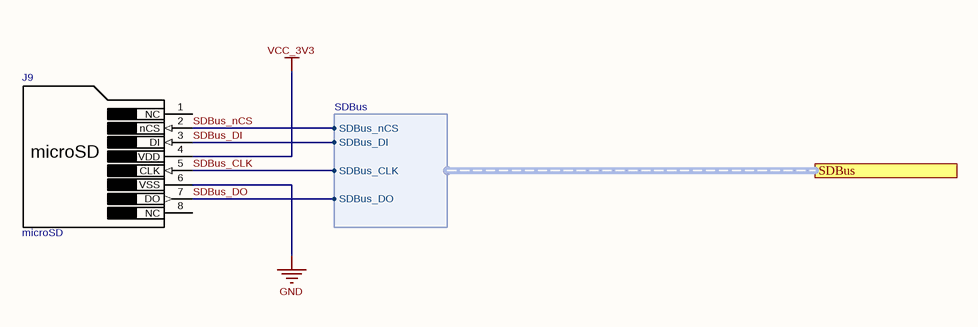
[diagram p12: dmpro16-pcb-v1-SDcard.SchDoc]

### Parts
J9  microSD  [114-00841-68-1-ND]

### Ports
SDBus (harness SDBus)

### Harnesses
SDBus: SDBus_nCS, SDBus_DI, SDBus_CLK, SDBus_DO

### Nets
GND: J9.6(VSS)
VCC_3V3: J9.4(VDD)
SDBus_CLK: J9.5(CLK) ; port SDBus.SDBus_CLK
SDBus_DI: J9.3(DI) ; port SDBus.SDBus_DI
SDBus_DO: J9.7(DO) ; port SDBus.SDBus_DO
SDBus_nCS: J9.2(nCS) ; port SDBus.SDBus_nCS

Not connected (* = marked no-connect by the designer): J9 1(NC) 8(NC)

### Notes on the sheet
- Board:
- Version:
- Sheetname:
- Subject:
- Group:
- Sheet
- of
- Shematic file:

### Library data of the parts
J9 = con_sd_microsd

## Sheet dmpro16-pcb-v1-DisplayBoard.SchDoc
size A4; DocumentNumber: 3; SheetNumber: 3; SheetTotal: 17; SheetName: DisplayBoard
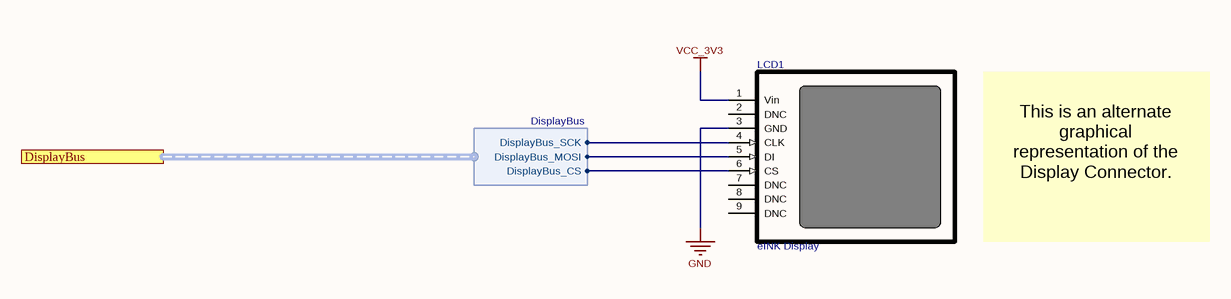
[diagram p13: dmpro16-pcb-v1-DisplayBoard.SchDoc]

### Parts
LCD1  eINK Display  [HEADER_1X9]

### Ports
DisplayBus (harness DisplayBus)

### Harnesses
DisplayBus: DisplayBus_MOSI, DisplayBus_SCK, DisplayBus_CS

### Nets
GND: LCD1.3(GND)
VCC_3V3: LCD1.1(Vin)
NetLCD1_4: LCD1.4(CLK) ; port DisplayBus.DisplayBus_SCK
NetLCD1_5: LCD1.5(DI) ; port DisplayBus.DisplayBus_MOSI
NetLCD1_6: LCD1.6(CS) ; port DisplayBus.DisplayBus_CS

Not connected (* = marked no-connect by the designer): LCD1 2(DNC) 7(DNC) 8(DNC) 9(DNC)

### Notes on the sheet
- This is an alternate graphical representation of the Display Connector.
- Board:
- Version:
- Sheetname:
- Subject:
- Group:
- Sheet
- of
- Shematic file:

### Library data of the parts
LCD1 = disp_eink

## Sheet dmpro16-pcb-v1-UserInput.SchDoc
size A4; DocumentNumber: 17; SheetNumber: 17; SheetTotal: 17; SheetName: UserInput
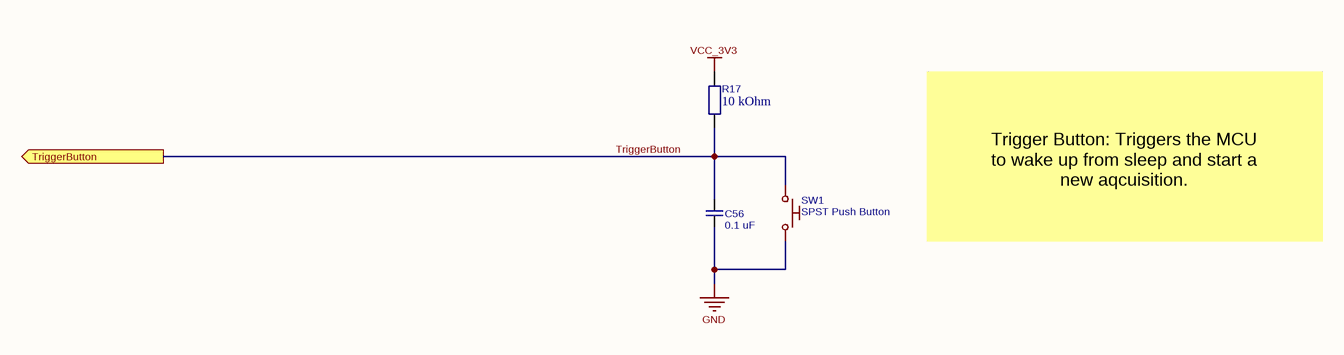
[diagram p14: dmpro16-pcb-v1-UserInput.SchDoc]

### Parts
C56  0.1 uF  [CAPC2012_0h50]
R17  10 kOhm  [Resistor 2012]
SW1  SPST Push Button  [HEADER_1X2]

### Ports
TriggerButton (out)

### Nets
GND: C56.1 SW1.2
VCC_3V3: R17.1
TriggerButton: C56.2 R17.2 SW1.1 ; port TriggerButton

### Notes on the sheet
- Trigger Button: Triggers the MCU to wake up from sleep and start a new aqcuisition.
- Board:
- Version:
- Sheetname:
- Subject:
- Group:
- Sheet
- of
- Shematic file:

### Library data of the parts
C56 = cap_unpol_1608_0.1uF: as C59 on sheet dmpro16-pcb-v1-MCU-Power; Ideal Value: 0.1 uF
R17 = res_1608_10kohm: as R1 on sheet dmpro16-pcb-v1-FPGA-Bank14; Value: 10 kOhm
SW1 = mech_button_spst: Single Pole Single Throw Push Button

## Sheet dmpro16-pcb-v1-PowerSupply.SchDoc
size A4; DocumentNumber: 14; SheetNumber: 14; SheetTotal: 17; SheetName: PowerSupply
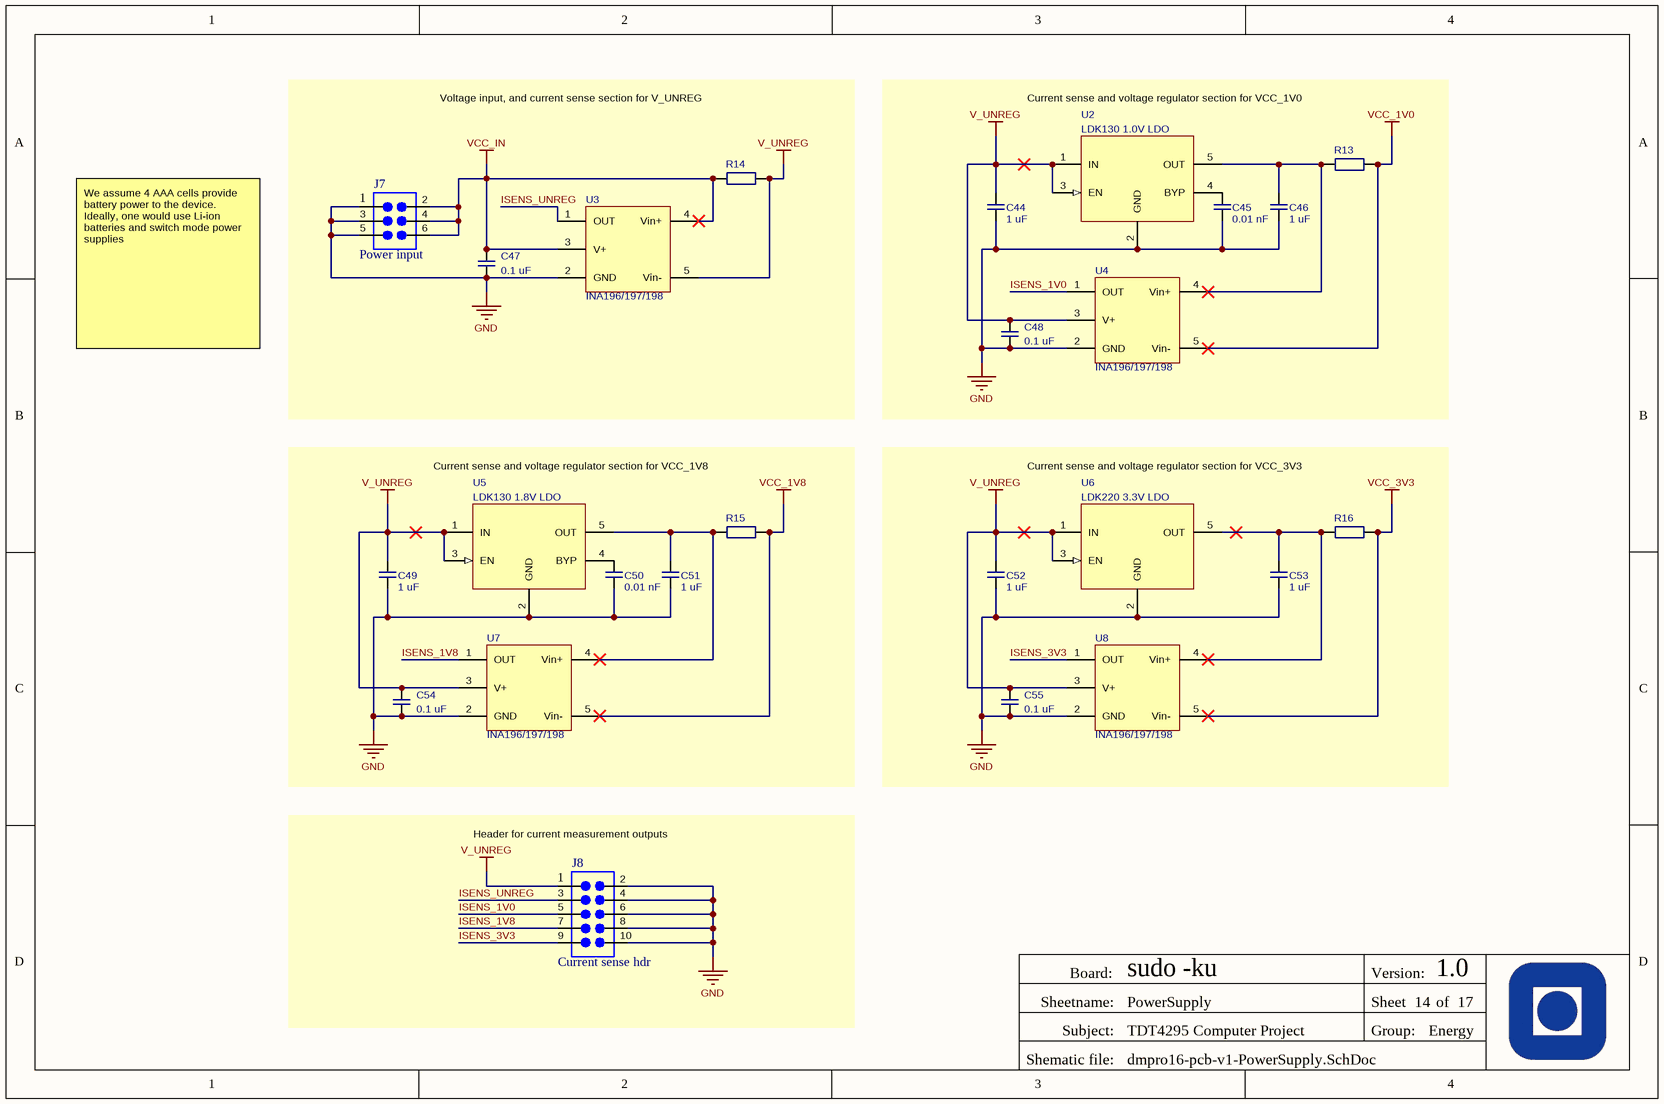
[diagram p15: dmpro16-pcb-v1-PowerSupply.SchDoc]

### Parts
C44  1 uF  [CAPC2012_0h50]
C45  0.01 nF  [CAPC2012_0h50]
C46  1 uF  [CAPC2012_0h50]
C47  0.1 uF  [CAPC2012_0h50]
C48  0.1 uF  [CAPC2012_0h50]
C49  1 uF  [CAPC2012_0h50]
C50  0.01 nF  [CAPC2012_0h50]
C51  1 uF  [CAPC2012_0h50]
C52  1 uF  [CAPC2012_0h50]
C53  1 uF  [CAPC2012_0h50]
C54  0.1 uF  [CAPC2012_0h50]
C55  0.1 uF  [CAPC2012_0h50]
J7  Power input  [HEADER_2X3]
J8  Current sense hdr  [HEADER_2X5]
R13  (no value)  [Resistor 3216]
R14  (no value)  [Resistor 3216]
R15  (no value)  [Resistor 3216]
R16  (no value)  [Resistor 3216]
U2  LDK130 1.0V LDO  [SOT23-5-127P600-8N]
U3  INA196/197/198  [SOT23-5-127P600-8N]
U4  INA196/197/198  [SOT23-5-127P600-8N]
U5  LDK130 1.8V LDO  [SOT23-5-127P600-8N]
U6  LDK220 3.3V LDO  [SOT23-5-127P600-8N]
U7  INA196/197/198  [SOT23-5-127P600-8N]
U8  INA196/197/198  [SOT23-5-127P600-8N]

### Nets
GND: C44.1 C45.1 C46.1 C47.1 C48.1 C49.1 C50.1 C51.1 C52.1 C53.1 C54.1 C55.1 J7.1 J7.3 J7.5 J8.2 J8.4 J8.6 J8.8 J8.10 U2.2(GND) U3.2(GND) U4.2(GND) U5.2(GND) U6.2(GND) U7.2(GND) U8.2(GND)
V_UNREG: C44.2 C48.2 C49.2 C52.2 C54.2 C55.2 J8.1 R14.1 U2.1(IN) U2.3(EN) U3.5(Vin-) U4.3(V+) U5.1(IN) U5.3(EN) U6.1(IN) U6.3(EN) U7.3(V+) U8.3(V+)
VCC_1V0: R13.1 U4.5(Vin-)
VCC_1V8: R15.1 U7.5(Vin-)
VCC_3V3: R16.1 U8.5(Vin-)
VCC_IN: C47.2 J7.2 J7.4 J7.6 R14.2 U3.3(V+) U3.4(Vin+)
ISENS_1V0: J8.5 U4.1(OUT)
ISENS_1V8: J8.7 U7.1(OUT)
ISENS_3V3: J8.9 U8.1(OUT)
ISENS_UNREG: J8.3 U3.1(OUT)
NetC45_2: C45.2 U2.4(BYP)
NetC46_2: C46.2 R13.2 U2.5(OUT) U4.4(Vin+)
NetC50_2: C50.2 U5.4(BYP)
NetC51_2: C51.2 R15.2 U5.5(OUT) U7.4(Vin+)
NetC53_2: C53.2 R16.2 U6.5(OUT) U8.4(Vin+)

Not connected (* = marked no-connect by the designer): U6 4(NC)

### Notes on the sheet
- We assume 4 AAA cells provide battery power to the device. Ideally, one would use Li-ion batteries and switch mode power supplies
- Voltage input, and current sense section for V_UNREG
- Current sense and voltage regulator section for VCC_1V0
- Current sense and voltage regulator section for VCC_1V8
- Current sense and voltage regulator section for VCC_3V3
- (near J8) Header for current measurement outputs
- Board:
- Version:
- Sheetname:
- Subject:
- Group:
- Sheet
- of
- Shematic file:

### Library data of the parts
C44 C46 C49 C51-C53 = cap_unpol_1608_1uF: as C57 on sheet dmpro16-pcb-v1-MCU-GPIO; Ideal Value: 1 uF
C45 C50 = cap_unpol_1608_0.01uF: as C67 on sheet dmpro16-pcb-v1-MCU-Power; Ideal Value: 0.01 nF
C47 C48 C54 C55 = cap_unpol_1608_0.1uF: as C59 on sheet dmpro16-pcb-v1-MCU-Power; Ideal Value: 0.1 uF
J7 = con_head_2x03pin: Header 2x03pin
J8 = con_head_2x05pin: Header 2x05pin
R13-R16 = res_currentsense: Current sense resistor; Watt rating: ? mW
U2 = ic_vreg_ldo_1v0_ldk130m10r: Output Voltage: 1.0 V
U3 U4 U7 U8 = ic_currentsense_ina196/197/198
U5 = ic_vreg_ldo_1v8_ldk130m18r: Output Voltage: 1.8 V
U6 = ic_vreg_ldo_3v3_ldk220m33r: Output Voltage: 3.3 V

## Sheet dmpro16-pcb-v1-SystemClock.SchDoc
size A4; DocumentNumber: 16; SheetNumber: 16; SheetTotal: 17; SheetName: SystemClock
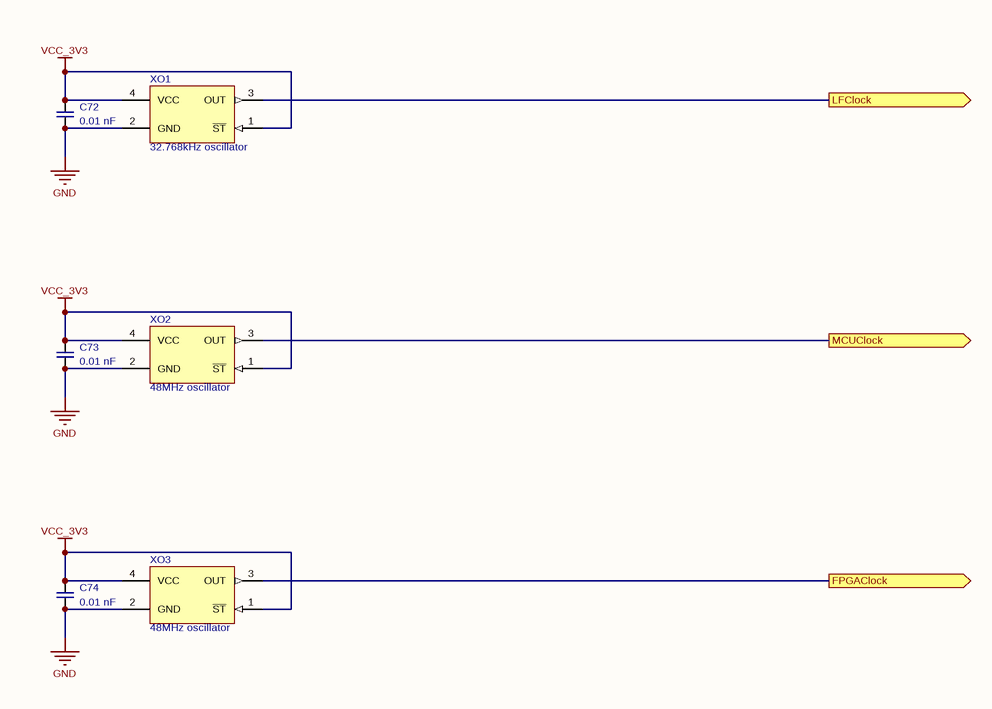
[diagram p16: dmpro16-pcb-v1-SystemClock.SchDoc]

### Parts
C72  0.01 nF  [CAPC2012_0h50]
C73  0.01 nF  [CAPC2012_0h50]
C74  0.01 nF  [CAPC2012_0h50]
XO1  32.768kHz oscillator  [FXO-HC73]
XO2  48MHz oscillator  [FXO-HC73]
XO3  48MHz oscillator  [FXO-HC73]

### Ports
FPGAClock (out), LFClock (out), MCUClock (out)

### Nets
GND: C72.1 C73.1 C74.1 XO1.2(GND) XO2.2(GND) XO3.2(GND)
VCC_3V3: C72.2 C73.2 C74.2 XO1.1(~{ST}) XO1.4(VCC) XO2.1(~{ST}) XO2.4(VCC) XO3.1(~{ST}) XO3.4(VCC)
NetU1_H2: XO3.3(OUT) ; port FPGAClock
NetU9_L1: XO1.3(OUT) ; port LFClock
NetU9_L9: XO2.3(OUT) ; port MCUClock

### Notes on the sheet
- Board:
- Version:
- Sheetname:
- Subject:
- Group:
- Sheet
- of
- Shematic file:

### Library data of the parts
C72-C74 = cap_unpol_1608_0.01uF: as C67 on sheet dmpro16-pcb-v1-MCU-Power; Ideal Value: 0.01 nF
XO1 = osc_smd_standard_32.768kHz: Supply Voltage: 3.3 V; Frequency: 32.768 kHz
XO2 XO3 = osc_smd_standard_48MHz: Supply Voltage: 3.3 V; Frequency: 48 MHz

## Nets that join several sheets
GND: dmpro16-pcb-v1-FPGA-Bank14 (J2.10 J3.10 R2.2), dmpro16-pcb-v1-FPGA-Power (74 pins), dmpro16-pcb-v1-FPGA-Config (18 pins), dmpro16-pcb-v1-MCU-Power (24 pins), dmpro16-pcb-v1-MCU-GPIO (11 pins), dmpro16-pcb-v1-CameraBoard (J1.1 J1.4 J1.7 J1.10), dmpro16-pcb-v1-SDcard (J9.6), dmpro16-pcb-v1-DisplayBoard (LCD1.3), dmpro16-pcb-v1-UserInput (C56.1 SW1.2), dmpro16-pcb-v1-PowerSupply (27 pins), dmpro16-pcb-v1-SystemClock (6 pins)
VCC_1V0: dmpro16-pcb-v1-FPGA-Power (17 pins), dmpro16-pcb-v1-PowerSupply (R13.1 U4.5)
VCC_1V8: dmpro16-pcb-v1-FPGA-Power (10 pins), dmpro16-pcb-v1-PowerSupply (R15.1 U7.5)
VCC_3V3: dmpro16-pcb-v1-FPGA-Bank14 (R1.1), dmpro16-pcb-v1-FPGA-Power (51 pins), dmpro16-pcb-v1-FPGA-Config (12 pins), dmpro16-pcb-v1-MCU-Power (24 pins), dmpro16-pcb-v1-MCU-GPIO (J11.1), dmpro16-pcb-v1-CameraBoard (J1.15), dmpro16-pcb-v1-SDcard (J9.4), dmpro16-pcb-v1-DisplayBoard (LCD1.1), dmpro16-pcb-v1-UserInput (R17.1), dmpro16-pcb-v1-PowerSupply (R16.1 U8.5), dmpro16-pcb-v1-SystemClock (9 pins)
CameraBus_CAM1_CN: dmpro16-pcb-v1-FPGA-Bank35 (U1.C7), dmpro16-pcb-v1-CameraBoard (J1.8)
CameraBus_CAM1_CP: dmpro16-pcb-v1-FPGA-Bank35 (U1.A3), dmpro16-pcb-v1-CameraBoard (J1.9)
CameraBus_CAM1_DN0: dmpro16-pcb-v1-FPGA-Bank35 (U1.C3), dmpro16-pcb-v1-CameraBoard (J1.2)
CameraBus_CAM1_DN1: dmpro16-pcb-v1-FPGA-Bank35 (U1.D6), dmpro16-pcb-v1-CameraBoard (J1.5)
CameraBus_CAM1_DP0: dmpro16-pcb-v1-FPGA-Bank35 (U1.D5), dmpro16-pcb-v1-CameraBoard (J1.3)
CameraBus_CAM1_DP1: dmpro16-pcb-v1-FPGA-Bank35 (U1.C6), dmpro16-pcb-v1-CameraBoard (J1.6)
CameraBus_CAM_CLK: dmpro16-pcb-v1-FPGA-Bank35 (U1.A4), dmpro16-pcb-v1-CameraBoard (J1.12)
CameraBus_CAM_GPIO: dmpro16-pcb-v1-FPGA-Bank35 (U1.B4), dmpro16-pcb-v1-CameraBoard (J1.11)
CameraBus_SCL0: dmpro16-pcb-v1-FPGA-Bank35 (U1.A5), dmpro16-pcb-v1-CameraBoard (J1.13)
CameraBus_SDA0: dmpro16-pcb-v1-FPGA-Bank35 (U1.B5), dmpro16-pcb-v1-CameraBoard (J1.14)
FPGABus_0: dmpro16-pcb-v1-FPGA-Bank15 (U1.D9), dmpro16-pcb-v1-MCU-GPIO (U9.E9)
FPGABus_1: dmpro16-pcb-v1-FPGA-Bank15 (U1.A13), dmpro16-pcb-v1-MCU-GPIO (U9.E10)
FPGABus_2: dmpro16-pcb-v1-FPGA-Bank15 (U1.A14), dmpro16-pcb-v1-MCU-GPIO (U9.F10)
FPGABus_3: dmpro16-pcb-v1-FPGA-Bank15 (U1.C14), dmpro16-pcb-v1-MCU-GPIO (U9.E11)
FPGABus_4: dmpro16-pcb-v1-FPGA-Bank15 (U1.B14), dmpro16-pcb-v1-MCU-GPIO (U9.A9)
FPGABus_5: dmpro16-pcb-v1-FPGA-Bank15 (U1.B15), dmpro16-pcb-v1-MCU-GPIO (U9.B9)
FPGABus_6: dmpro16-pcb-v1-FPGA-Bank15 (U1.A15), dmpro16-pcb-v1-MCU-GPIO (U9.C9)
FPGABus_7: dmpro16-pcb-v1-FPGA-Bank15 (U1.C16), dmpro16-pcb-v1-MCU-GPIO (U9.D9)
FPGABus_8: dmpro16-pcb-v1-FPGA-Bank15 (U1.B16), dmpro16-pcb-v1-MCU-GPIO (U9.B4)
FPGABus_9: dmpro16-pcb-v1-FPGA-Bank15 (U1.C11), dmpro16-pcb-v1-MCU-GPIO (U9.A4)
FPGABus_10: dmpro16-pcb-v1-FPGA-Bank15 (U1.C12), dmpro16-pcb-v1-MCU-GPIO (U9.C3)
FPGABus_11: dmpro16-pcb-v1-FPGA-Bank15 (U1.D13), dmpro16-pcb-v1-MCU-GPIO (U9.B3)
FPGABus_12: dmpro16-pcb-v1-FPGA-Bank15 (U1.C13), dmpro16-pcb-v1-MCU-GPIO (U9.A3)
FPGABus_13: dmpro16-pcb-v1-FPGA-Bank15 (U1.E12), dmpro16-pcb-v1-MCU-GPIO (U9.B2)
FPGABus_14: dmpro16-pcb-v1-FPGA-Bank15 (U1.E13), dmpro16-pcb-v1-MCU-GPIO (U9.A2)
FPGABus_15: dmpro16-pcb-v1-FPGA-Bank15 (U1.E11), dmpro16-pcb-v1-MCU-GPIO (U9.A1)
NetLCD1_4: dmpro16-pcb-v1-MCU-GPIO (U9.J9), dmpro16-pcb-v1-DisplayBoard (LCD1.4)
NetLCD1_5: dmpro16-pcb-v1-MCU-GPIO (U9.L11), dmpro16-pcb-v1-DisplayBoard (LCD1.5)
NetLCD1_6: dmpro16-pcb-v1-MCU-GPIO (U9.J10), dmpro16-pcb-v1-DisplayBoard (LCD1.6)
NetU1_H2: dmpro16-pcb-v1-FPGA-Bank35 (U1.H2), dmpro16-pcb-v1-SystemClock (XO3.3)
NetU9_L1: dmpro16-pcb-v1-MCU-GPIO (U9.L1), dmpro16-pcb-v1-SystemClock (XO1.3)
NetU9_L9: dmpro16-pcb-v1-MCU-GPIO (U9.L9), dmpro16-pcb-v1-SystemClock (XO2.3)
SDBus_CLK: dmpro16-pcb-v1-FPGA-Bank35 (U1.G2), dmpro16-pcb-v1-SDcard (J9.5)
SDBus_DI: dmpro16-pcb-v1-FPGA-Bank35 (U1.G4), dmpro16-pcb-v1-SDcard (J9.3)
SDBus_DO: dmpro16-pcb-v1-FPGA-Bank35 (U1.G1), dmpro16-pcb-v1-SDcard (J9.7)
SDBus_nCS: dmpro16-pcb-v1-FPGA-Bank35 (U1.G5), dmpro16-pcb-v1-SDcard (J9.2)
TriggerButton: dmpro16-pcb-v1-MCU-GPIO (U9.C2), dmpro16-pcb-v1-UserInput (C56.2 R17.2 SW1.1)